# EAGLE design C64_1 (EAGLE 5.12)

## Sheet 1 of 5
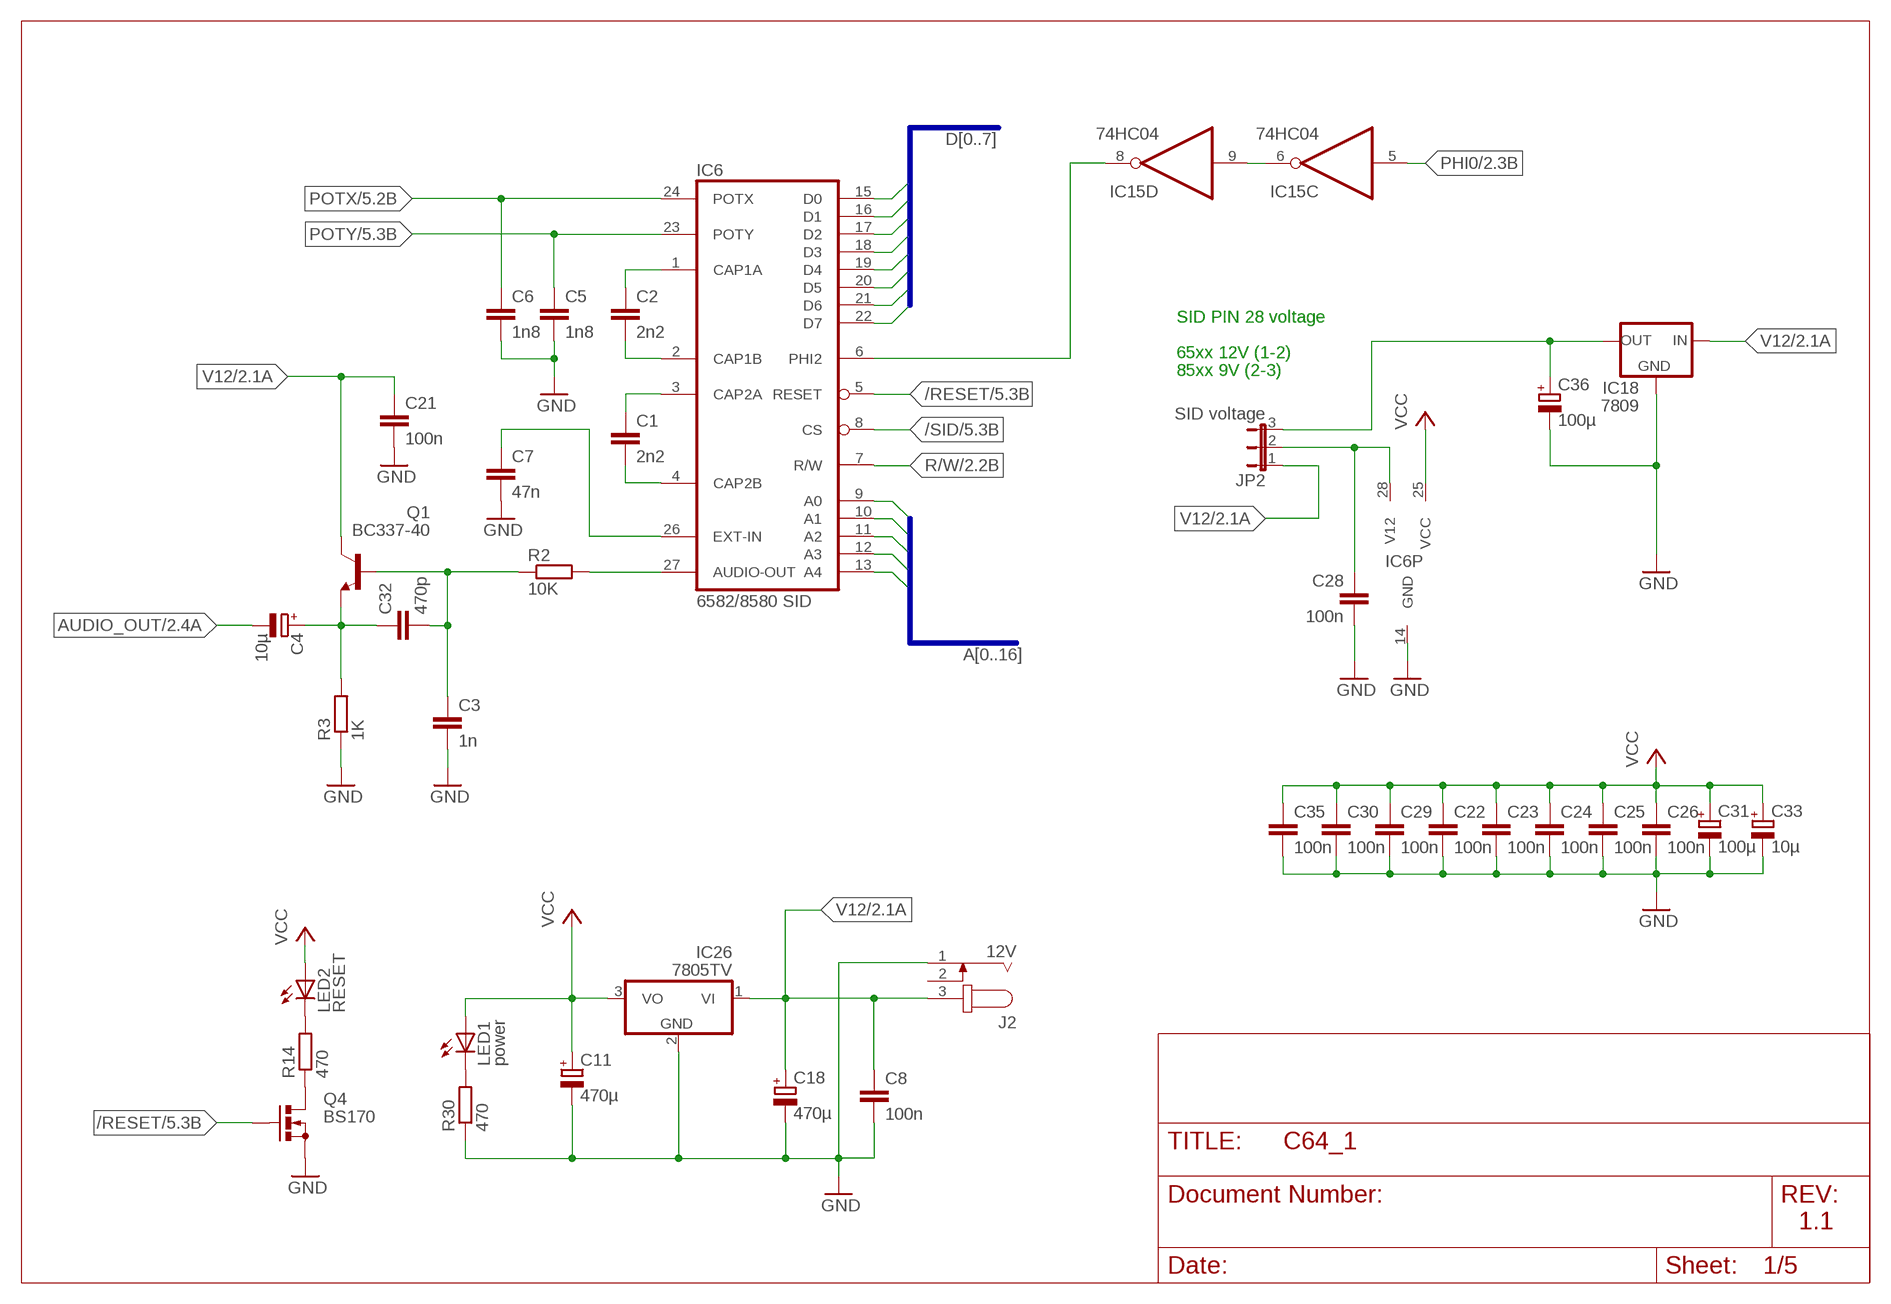
[diagram p0: schematic, sheet 1]

### Parts
C1  2n2  C-EU025-024X044  [C025-024X044]
C2  2n2  C-EU025-024X044  [C025-024X044]
C3  1n  C-EU025-024X044  [C025-024X044]
C4  10µ  CPOL-EUE2.5-6  [E2,5-6]
C5  1n8  C-EU025-024X044  [C025-024X044]
C6  1n8  C-EU025-024X044  [C025-024X044]
C7  47n  C-EU050-024X044  [C050-024X044]
C8  100n  C-EU050-024X044  [C050-024X044]
C11  470µ  CPOL-EUE3.5-8  [E3,5-8]
C18  470µ  CPOL-EUE3.5-8  [E3,5-8]
C21  100n  C-EU050-024X044  [C050-024X044]
C22  100n  C-EU050-024X044  [C050-024X044]
C23  100n  C-EU050-024X044  [C050-024X044]
C24  100n  C-EU050-024X044  [C050-024X044]
C25  100n  C-EU050-024X044  [C050-024X044]
C26  100n  C-EU050-024X044  [C050-024X044]
C28  100n  C-EU050-024X044  [C050-024X044]
C29  100n  C-EU050-024X044  [C050-024X044]
C30  100n  C-EU050-024X044  [C050-024X044]
C31  100µ  CPOL-EUE2.5-6  [E2,5-6]
C32  470p  C-EU025-024X044  [C025-024X044]
C33  10µ  CPOL-EUE2-4  [E2-4]
C35  100n  C-EU050-024X044  [C050-024X044]
C36  100µ  CPOL-EUE2.5-6  [E2,5-6]
IC6  6582/8580 SID  6581  [DIL28]
IC15  74HC04  74LS04N  [DIL14]
IC18  7809  78XXS  [78XXS]
IC26  7805TV  [TO220V]
J2  12V  JACK-PLUG0  [SPC4077]
JP2  SID voltage  JP2E  [JP2]
LED1  power  LED5MM  [LED5MM]
LED2  RESET  LED5MM  [LED5MM]
Q1  BC337-40  [TO92]
Q4  BS170  [SOT54E]
R2  10K  R-EU_0207/2V  [0207/2V]
R3  1K  R-EU_0207/2V  [0207/2V]
R14  470  R-EU_0207/7  [0207/7]
R30  470  R-EU_0207/7  [0207/7]

### Nets
/RESET: IC6.5(RESET) Q4.G ; also sheet 5
/SID: IC6.8(CS) ; also sheet 5
A0: IC6.9(A0) ; also sheet 3,5
A1: IC6.10(A1) ; also sheet 3,5
A2: IC6.11(A2) ; also sheet 3,5
A3: IC6.12(A3) ; also sheet 3,5
A4: IC6.13(A4) ; also sheet 3,5
AUDIO_OUT: C4.- ; also sheet 2
D0: IC6.15(D0) ; also sheet 2,3,5
D1: IC6.16(D1) ; also sheet 2,3,5
D2: IC6.17(D2) ; also sheet 2,3,5
D3: IC6.18(D3) ; also sheet 2,3,5
D4: IC6.19(D4) ; also sheet 2,5
D5: IC6.20(D5) ; also sheet 2,5
D6: IC6.21(D6) ; also sheet 2,5
D7: IC6.22(D7) ; also sheet 2,5
EXT-IN: C7.1 IC6.26(EXT-IN)
GND: C3.2 C5.2 C6.2 C7.2 C8.2 C11.- C18.- C21.2 C22.2 C23.2 C24.2 C25.2 C26.2 C28.2 C29.2 C30.2 C31.- C33.- C35.2 C36.- IC6.14(GND) IC18.GND IC26.2(GND) J2.1 Q4.S R3.1 R30.1 ; also sheet 2,3,4,5
N$1: C2.1 IC6.1(CAP1A)
N$2: C2.2 IC6.2(CAP1B)
N$3: C1.2 IC6.4(CAP2B)
N$4: C1.1 IC6.3(CAP2A)
N$6: C4.+ C32.1 Q1.1(E) R3.2
N$7: C3.1 C32.2 Q1.2(B) R2.1
N$8: LED1.K(C) R30.2
N$9: IC15.6(C:O) IC15.9(D:I)
N$17: LED2.K(C) R14.2
N$18: Q4.D R14.1
PHI0: IC15.5(C:I) ; also sheet 2,4,5
POTX: C6.1 IC6.24(POTX) ; also sheet 5
POTY: C5.1 IC6.23(POTY) ; also sheet 5
R/W: IC6.7(R/W) ; also sheet 2,5
SID_AUDIO_OUT: IC6.27(AUDIO-OUT) R2.2
SID_PHI2: IC6.6(PHI2) IC15.8(D:O)
V9: C36.+ IC18.OUT JP2.3
V12: C8.1 C18.+ C21.1 IC18.IN IC26.1(VI) J2.3 JP2.1 Q1.3(C) ; also sheet 2
V_SID: C28.1 IC6.28(V12) JP2.2
VCC: C11.+ C22.1 C23.1 C24.1 C25.1 C26.1 C29.1 C30.1 C31.+ C33.+ C35.1 IC6.25(VCC) IC26.3(VO) LED1.A LED2.A ; also sheet 2,3,4,5
Unconnected: J2.2

### Buses
D[0..7]
A[0..16]

### Notes on the sheet
- SID PIN 28 voltage
- 65xx 12V (1-2)
- 85xx 9V (2-3)
- 1.1

## Sheet 2 of 5
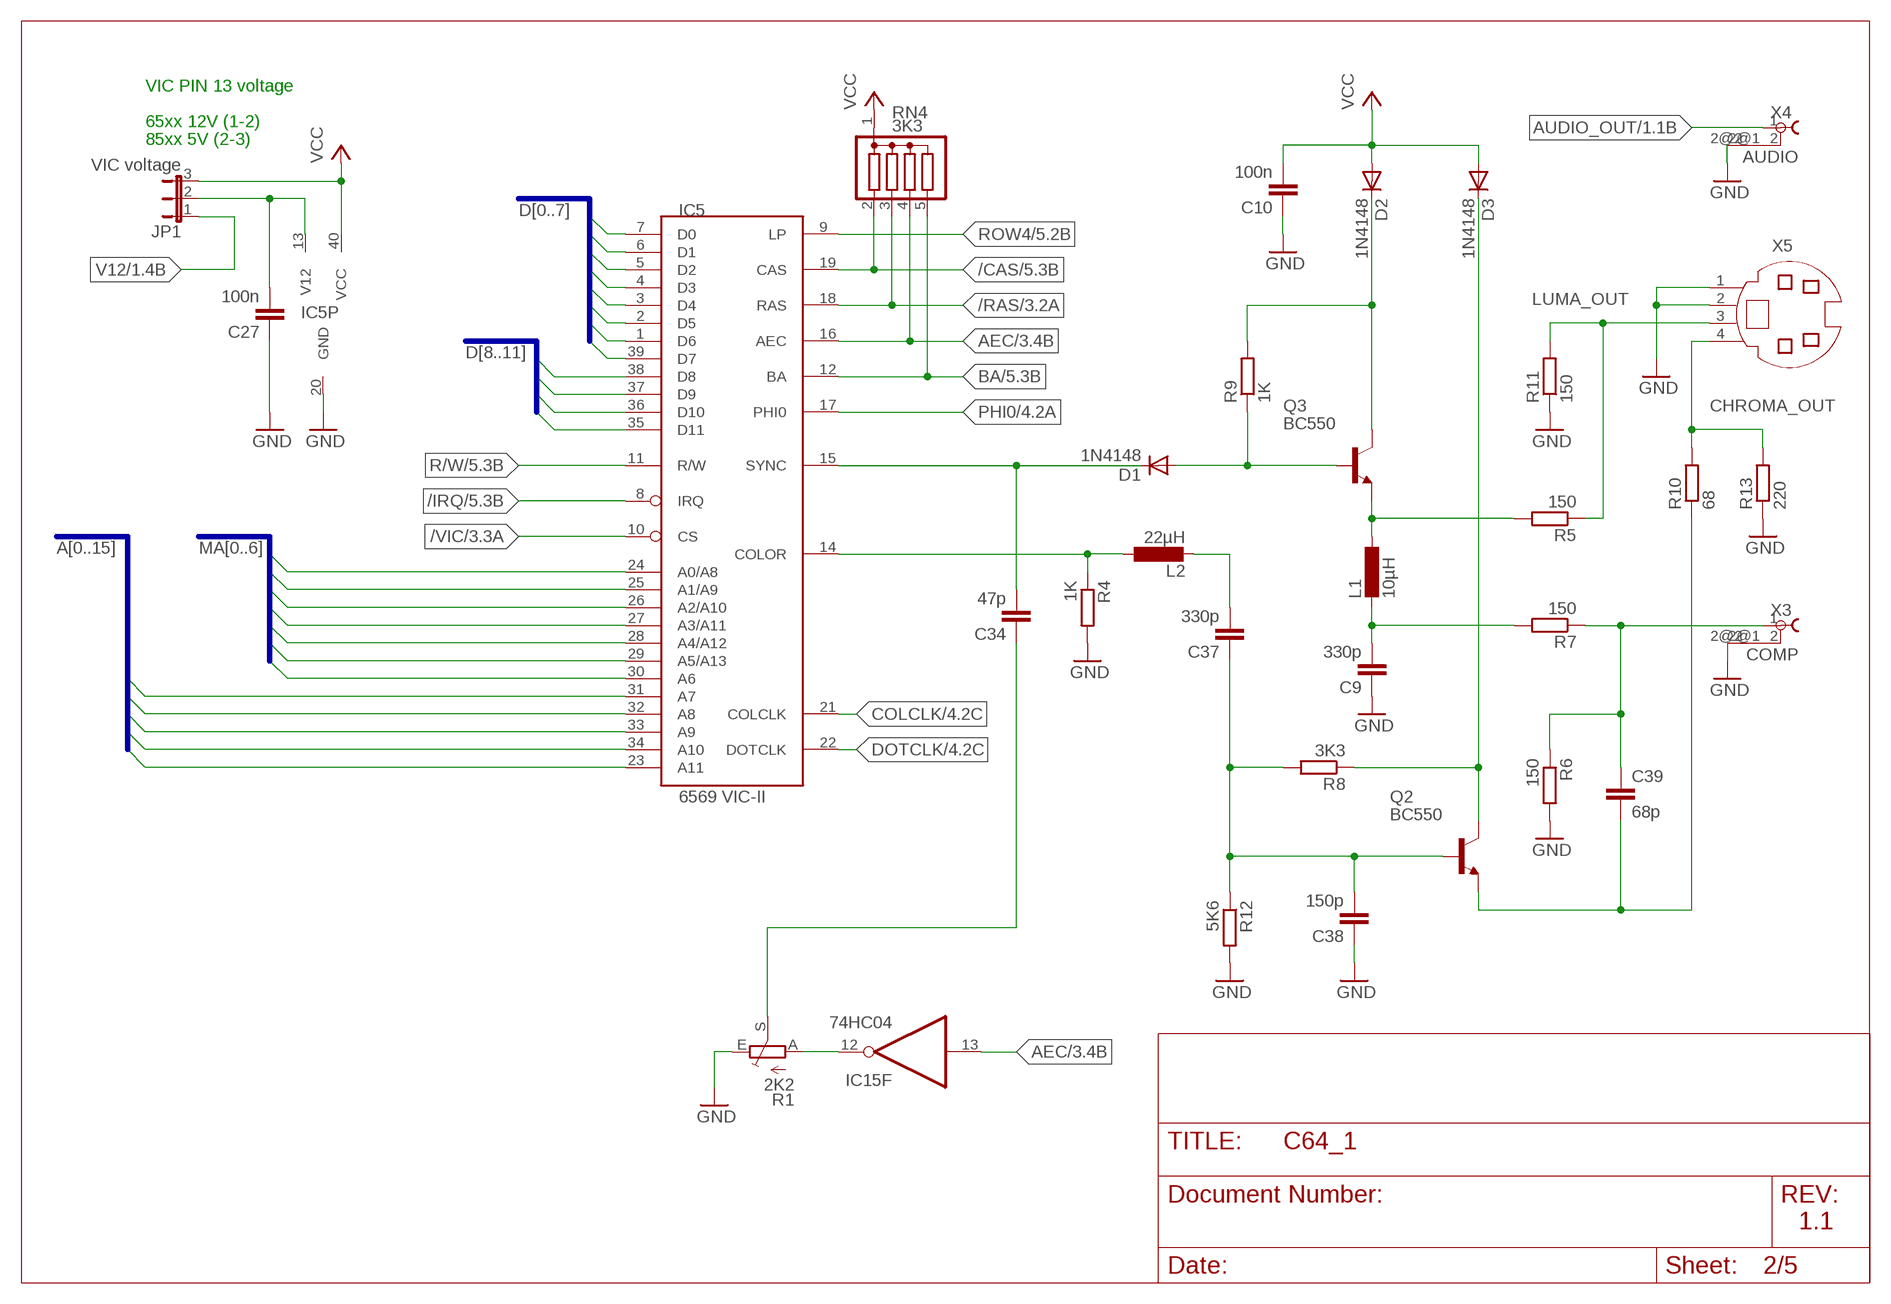
[diagram p1: schematic, sheet 2]

### Parts
C9  330p  C-EU050-024X044  [C050-024X044]
C10  100n  C-EU050-024X044  [C050-024X044]
C27  100n  C-EU050-024X044  [C050-024X044]
C34  47p  C-EU025-024X044  [C025-024X044]
C37  330p  C-EU050-024X044  [C050-024X044]
C38  150p  C-EU050-024X044  [C050-024X044]
C39  68p  C-EU050-024X044  [C050-024X044]
D1  1N4148  1N4148DO35-7  [DO35-7]
D2  1N4148  1N4148DO35-7  [DO35-7]
D3  1N4148  1N4148DO35-7  [DO35-7]
IC5  6569 VIC-II  6569  [DIP40]
JP1  VIC voltage  JP2E  [JP2]
L1  10µH  L-EU0207/2V  [0207/2V]
L2  22µH  L-EU0207/2V  [0207/2V]
Q2  BC550  BC548  [TO92-EBC]
Q3  BC550  BC548  [TO92-EBC]
R1  2K2  TRIM_EU-RJ9W  [RJ9W]
R4  1K  R-EU_0207/2V  [0207/2V]
R5  150  R-EU_0207/7  [0207/7]
R6  150  R-EU_0207/2V  [0207/2V]
R7  150  R-EU_0207/2V  [0207/2V]
R8  3K3  R-EU_0207/2V  [0207/2V]
R9  1K  R-EU_0207/7  [0207/7]
R10  68  R-EU_0207/2V  [0207/2V]
R11  150  R-EU_0207/2V  [0207/2V]
R12  5K6  R-EU_0207/2V  [0207/2V]
R13  220  R-EU_0207/2V  [0207/2V]
RN4  3K3  G04R  [SIL5]
X3  COMP  TOBU3  [TOBU3]
X4  AUDIO  TOBU3  [TOBU3]
X5  MD04SS  [MDIN04SS]

### Nets
/CAS: IC5.19(CAS) RN4.2 ; also sheet 5
/IRQ: IC5.8(IRQ) ; also sheet 5
/RAS: IC5.18(RAS) RN4.3 ; also sheet 3
/VIC: IC5.10(CS) ; also sheet 3,5
A7: IC5.31(A7) ; also sheet 3,5
A8: IC5.32(A8) ; also sheet 3,5
A9: IC5.33(A9) ; also sheet 3,5
A10: IC5.34(A10) ; also sheet 5
A11: IC5.23(A11) ; also sheet 5
AEC: IC5.16(AEC) IC15.13(F:I) RN4.4 ; also sheet 3,5
AUDIO_OUT: X4.1 ; also sheet 1
BA: IC5.12(BA) RN4.5 ; also sheet 5
CHROMA_OUT: R10.2 R13.2 X5.4
COLCLK: IC5.21(COLCLK) ; also sheet 4
COLOR: IC5.14(COLOR) L2.1 R4.1
COMP_OUT: C39.1 R6.1 R7.1 X3.1
D0: IC5.7(D0) ; also sheet 1,3,5
D1: IC5.6(D1) ; also sheet 1,3,5
D2: IC5.5(D2) ; also sheet 1,3,5
D3: IC5.4(D3) ; also sheet 1,3,5
D4: IC5.3(D4) ; also sheet 1,5
D5: IC5.2(D5) ; also sheet 1,5
D6: IC5.1(D6) ; also sheet 1,5
D7: IC5.39(D7) ; also sheet 1,5
D8: IC5.38(D8) ; also sheet 3
D9: IC5.37(D9) ; also sheet 3
D10: IC5.36(D10) ; also sheet 3
D11: IC5.35(D11) ; also sheet 3
DOTCLK: IC5.22(DOTCLK) ; also sheet 4,5
GND: C9.1 C10.1 C27.1 C38.1 IC5.20(GND) R1.E R4.2 R6.2 R11.1 R12.2 R13.1 X3.2@2 X4.2@2 X5.1 X5.2 ; also sheet 1,3,4,5
LUMA_OUT: R5.1 R11.2 X5.3
MA0: IC5.24(A0/A8) ; also sheet 3
MA1: IC5.25(A1/A9) ; also sheet 3
MA2: IC5.26(A2/A10) ; also sheet 3
MA3: IC5.27(A3/A11) ; also sheet 3
MA4: IC5.28(A4/A12) ; also sheet 3
MA5: IC5.29(A5/A13) ; also sheet 3
MA6: IC5.30(A6) ; also sheet 3
N$5: D3.C Q2.C R8.1
N$10: D1.A Q3.B R9.1
N$11: C37.1 C38.2 Q2.B R8.2 R12.1
N$12: D2.C Q3.C R9.2
N$13: C9.2 L1.2 R7.2
N$14: C34.1 R1.S
N$15: L1.1 Q3.E R5.2
N$16: IC15.12(F:O) R1.A
N$19: C37.2 L2.2
N$29: C39.2 Q2.E R10.1
PHI0: IC5.17(PHI0) ; also sheet 1,4,5
R/W: IC5.11(R/W) ; also sheet 1,5
ROW4: IC5.9(LP) ; also sheet 5
SYNC: C34.2 D1.C IC5.15(SYNC)
V12: JP1.1 ; also sheet 1
V_VIC: C27.2 IC5.13(V12) JP1.2
VCC: C10.2 D2.A D3.A IC5.40(VCC) JP1.3 RN4.1 ; also sheet 1,3,4,5
Unconnected: X3.2 X3.2@1 X4.2 X4.2@1

### Buses
D[0..7]
D[8..11]
MA[0..6]
A[0..15]

### Notes on the sheet
- VIC PIN 13 voltage
- 65xx 12V (1-2)
- 85xx 5V (2-3)
- 1.1

## Sheet 3 of 5
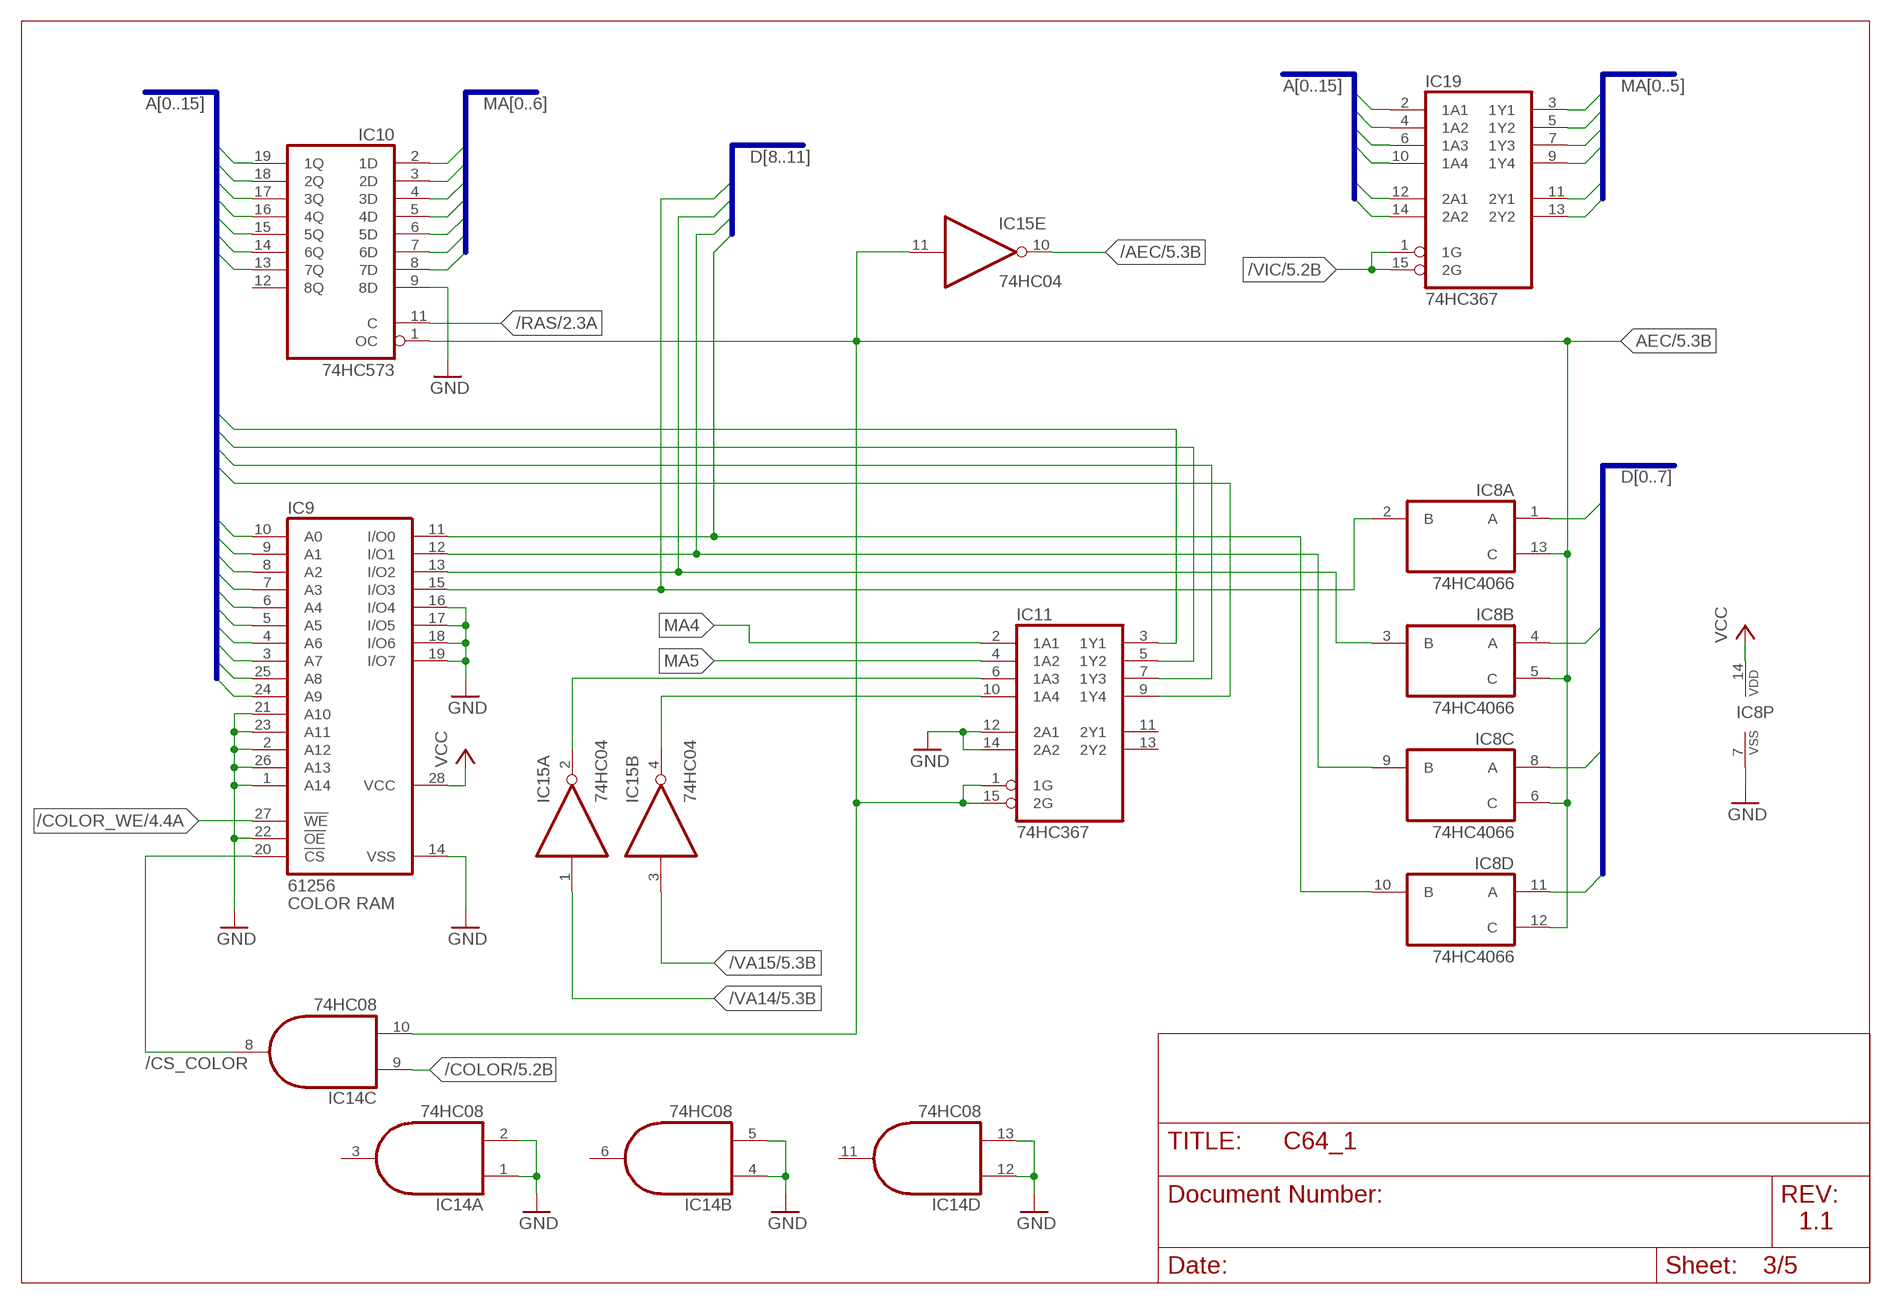
[diagram p2: schematic, sheet 3]

### Parts
IC8  74HC4066  4066N  [DIL14]
IC9  61256  62832P  [DIL28-3]
IC10  74HC573  74HC573N  [DIL20]
IC11  74HC367  74367N  [DIL16]
IC14  74HC08  74LS08N  [DIL14]
IC19  74HC367  74367N  [DIL16]

### Nets
/AEC: IC15.10(E:O) ; also sheet 5
/COLOR: IC14.9(C:I0) ; also sheet 5
/COLOR_WE: IC9.27(!WE) ; also sheet 4
/CS_COLOR: IC9.20(!CS) IC14.8(C:O)
/RAS: IC10.11(C) ; also sheet 2
/VA14: IC15.1(A:I) ; also sheet 5
/VA15: IC15.3(B:I) ; also sheet 5
/VIC: IC19.1(1G) IC19.15(2G) ; also sheet 2,5
A0: IC9.10(A0) IC10.19(1Q) IC19.2(1A1) ; also sheet 1,5
A1: IC9.9(A1) IC10.18(2Q) IC19.4(1A2) ; also sheet 1,5
A2: IC9.8(A2) IC10.17(3Q) IC19.6(1A3) ; also sheet 1,5
A3: IC9.7(A3) IC10.16(4Q) IC19.10(1A4) ; also sheet 1,5
A4: IC9.6(A4) IC10.15(5Q) IC19.12(2A1) ; also sheet 1,5
A5: IC9.5(A5) IC10.14(6Q) IC19.14(2A2) ; also sheet 5
A6: IC9.4(A6) IC10.13(7Q) ; also sheet 5
A7: IC9.3(A7) ; also sheet 2,5
A8: IC9.25(A8) ; also sheet 2,5
A9: IC9.24(A9) ; also sheet 2,5
A12: IC11.3(1Y1) ; also sheet 5
A13: IC11.5(1Y2) ; also sheet 5
A14: IC11.7(1Y3) ; also sheet 5
A15: IC11.9(1Y4) ; also sheet 5
AEC: IC8.5(B:C) IC8.6(C:C) IC8.12(D:C) IC8.13(A:C) IC10.1(OC) IC11.1(1G) IC11.15(2G) IC14.10(C:I1) IC15.11(E:I) ; also sheet 2,5
D0: IC8.11(D:A) ; also sheet 1,2,5
D1: IC8.8(C:A) ; also sheet 1,2,5
D2: IC8.4(B:A) ; also sheet 1,2,5
D3: IC8.1(A:A) ; also sheet 1,2,5
D8: IC8.10(D:B) IC9.11(I/O0) ; also sheet 2
D9: IC8.9(C:B) IC9.12(I/O1) ; also sheet 2
D10: IC8.3(B:B) IC9.13(I/O2) ; also sheet 2
D11: IC8.2(A:B) IC9.15(I/O3) ; also sheet 2
GND: IC8.7(P:VSS) IC9.1(A14) IC9.2(A12) IC9.14(VSS) IC9.16(I/O4) IC9.17(I/O5) IC9.18(I/O6) IC9.19(I/O7) IC9.21(A10) IC9.22(!OE) IC9.23(A11) IC9.26(A13) IC10.9(8D) IC11.12(2A1) IC11.14(2A2) IC14.1(A:I0) IC14.2(A:I1) IC14.4(B:I0) IC14.5(B:I1) IC14.12(D:I0) IC14.13(D:I1) ; also sheet 1,2,4,5
MA0: IC10.2(1D) IC19.3(1Y1) ; also sheet 2
MA1: IC10.3(2D) IC19.5(1Y2) ; also sheet 2
MA2: IC10.4(3D) IC19.7(1Y3) ; also sheet 2
MA3: IC10.5(4D) IC19.9(1Y4) ; also sheet 2
MA4: IC10.6(5D) IC11.2(1A1) IC19.11(2Y1) ; also sheet 2
MA5: IC10.7(6D) IC11.4(1A2) IC19.13(2Y2) ; also sheet 2
MA6: IC10.8(7D) ; also sheet 2
VA14: IC11.6(1A3) IC15.2(A:O)
VA15: IC11.10(1A4) IC15.4(B:O)
VCC: IC8.14(P:VDD) IC9.28(VCC) ; also sheet 1,2,4,5
Unconnected: IC10.12(8Q) IC11.11(2Y1) IC11.13(2Y2) IC14.3(A:O) IC14.6(B:O) IC14.11(D:O)

### Buses
D[0..7]
A[0..15]
MA[0..5]
D[8..11]
MA[0..6]

### Notes on the sheet
- COLOR RAM
- 1.1

## Sheet 4 of 5
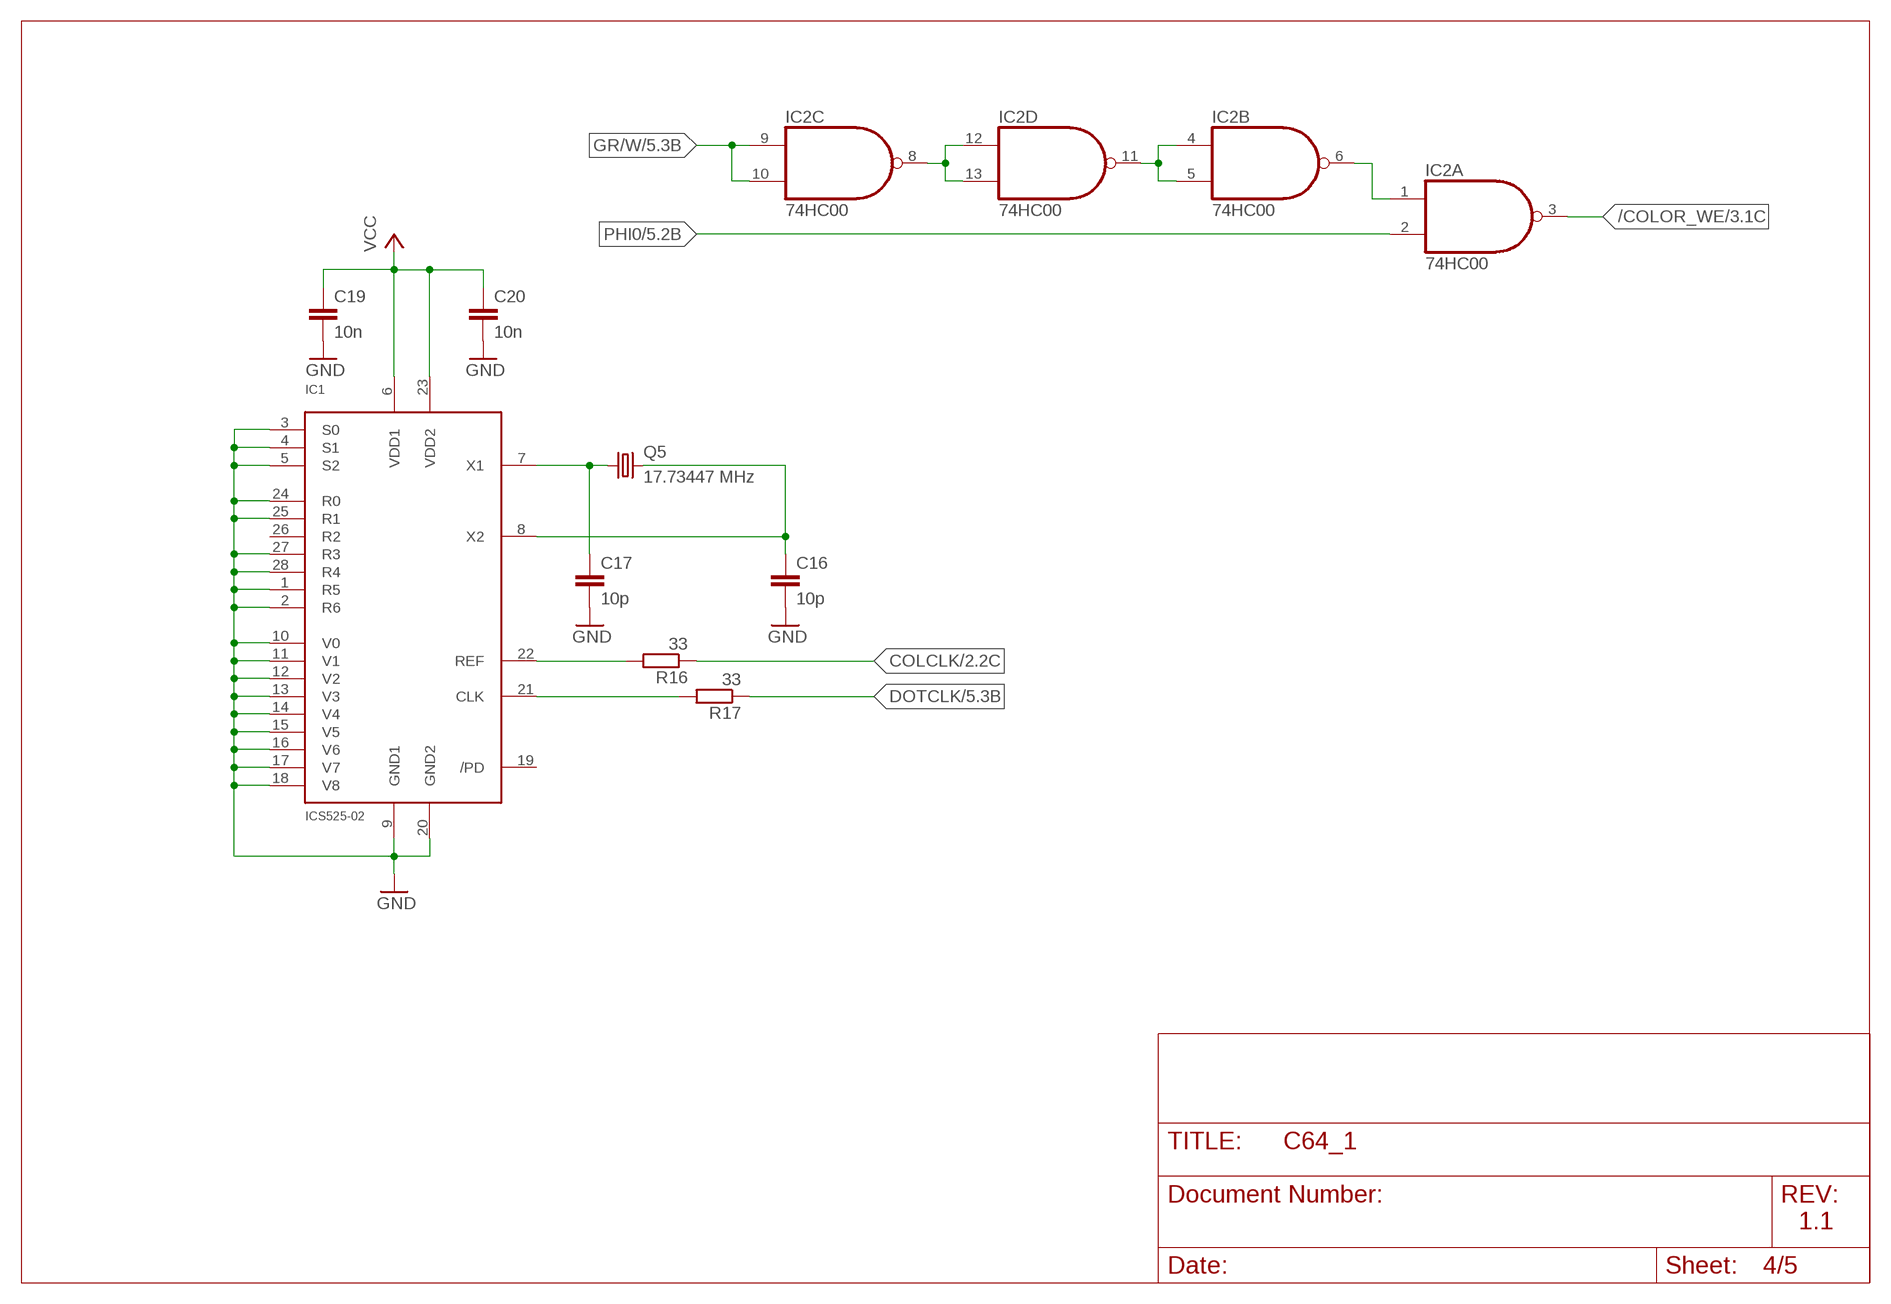
[diagram p3: schematic, sheet 4]

### Parts
C16  10p  C-EU025-024X044  [C025-024X044]
C17  10p  C-EU025-024X044  [C025-024X044]
C19  10n  C-EU025-024X044  [C025-024X044]
C20  10n  C-EU025-024X044  [C025-024X044]
IC1  ICS525-02  ICS525  [SSOP-28]
IC2  74HC00  7400N  [DIL14]
Q5  17.73447 MHz  CRYSTALHC49S  [HC49/S]
R16  33  R-EU_0207/7  [0207/7]
R17  33  R-EU_0207/7  [0207/7]

### Nets
/COLOR_WE: IC2.3(A:O) ; also sheet 3
COLCLK: R16.1 ; also sheet 2
DOTCLK: R17.1 ; also sheet 2,5
GND: C16.2 C17.2 C19.2 C20.2 IC1.1(R5) IC1.2(R6) IC1.3(S0) IC1.4(S1) IC1.5(S2) IC1.9(GND1) IC1.10(V0) IC1.11(V1) IC1.12(V2) IC1.13(V3) IC1.14(V4) IC1.15(V5) IC1.16(V6) IC1.17(V7) IC1.18(V8) IC1.20(GND2) IC1.24(R0) IC1.25(R1) IC1.27(R3) IC1.28(R4) ; also sheet 1,2,3,5
GR/W: IC2.9(C:I0) IC2.10(C:I1) ; also sheet 5
N$20: IC2.8(C:O) IC2.12(D:I0) IC2.13(D:I1)
N$21: IC2.1(A:I0) IC2.6(B:O)
N$22: C17.1 IC1.7(X1) Q5.1
N$23: C16.1 IC1.8(X2) Q5.2
N$24: IC1.22(REF) R16.2
N$25: IC1.21(CLK) R17.2
N$26: IC2.4(B:I0) IC2.5(B:I1) IC2.11(D:O)
PHI0: IC2.2(A:I1) ; also sheet 1,2,5
VCC: C19.1 C20.1 IC1.6(VDD1) IC1.23(VDD2) ; also sheet 1,2,3,5
Unconnected: IC1.19(/PD) IC1.26(R2)

### Notes on the sheet
- 1.1

## Sheet 5 of 5
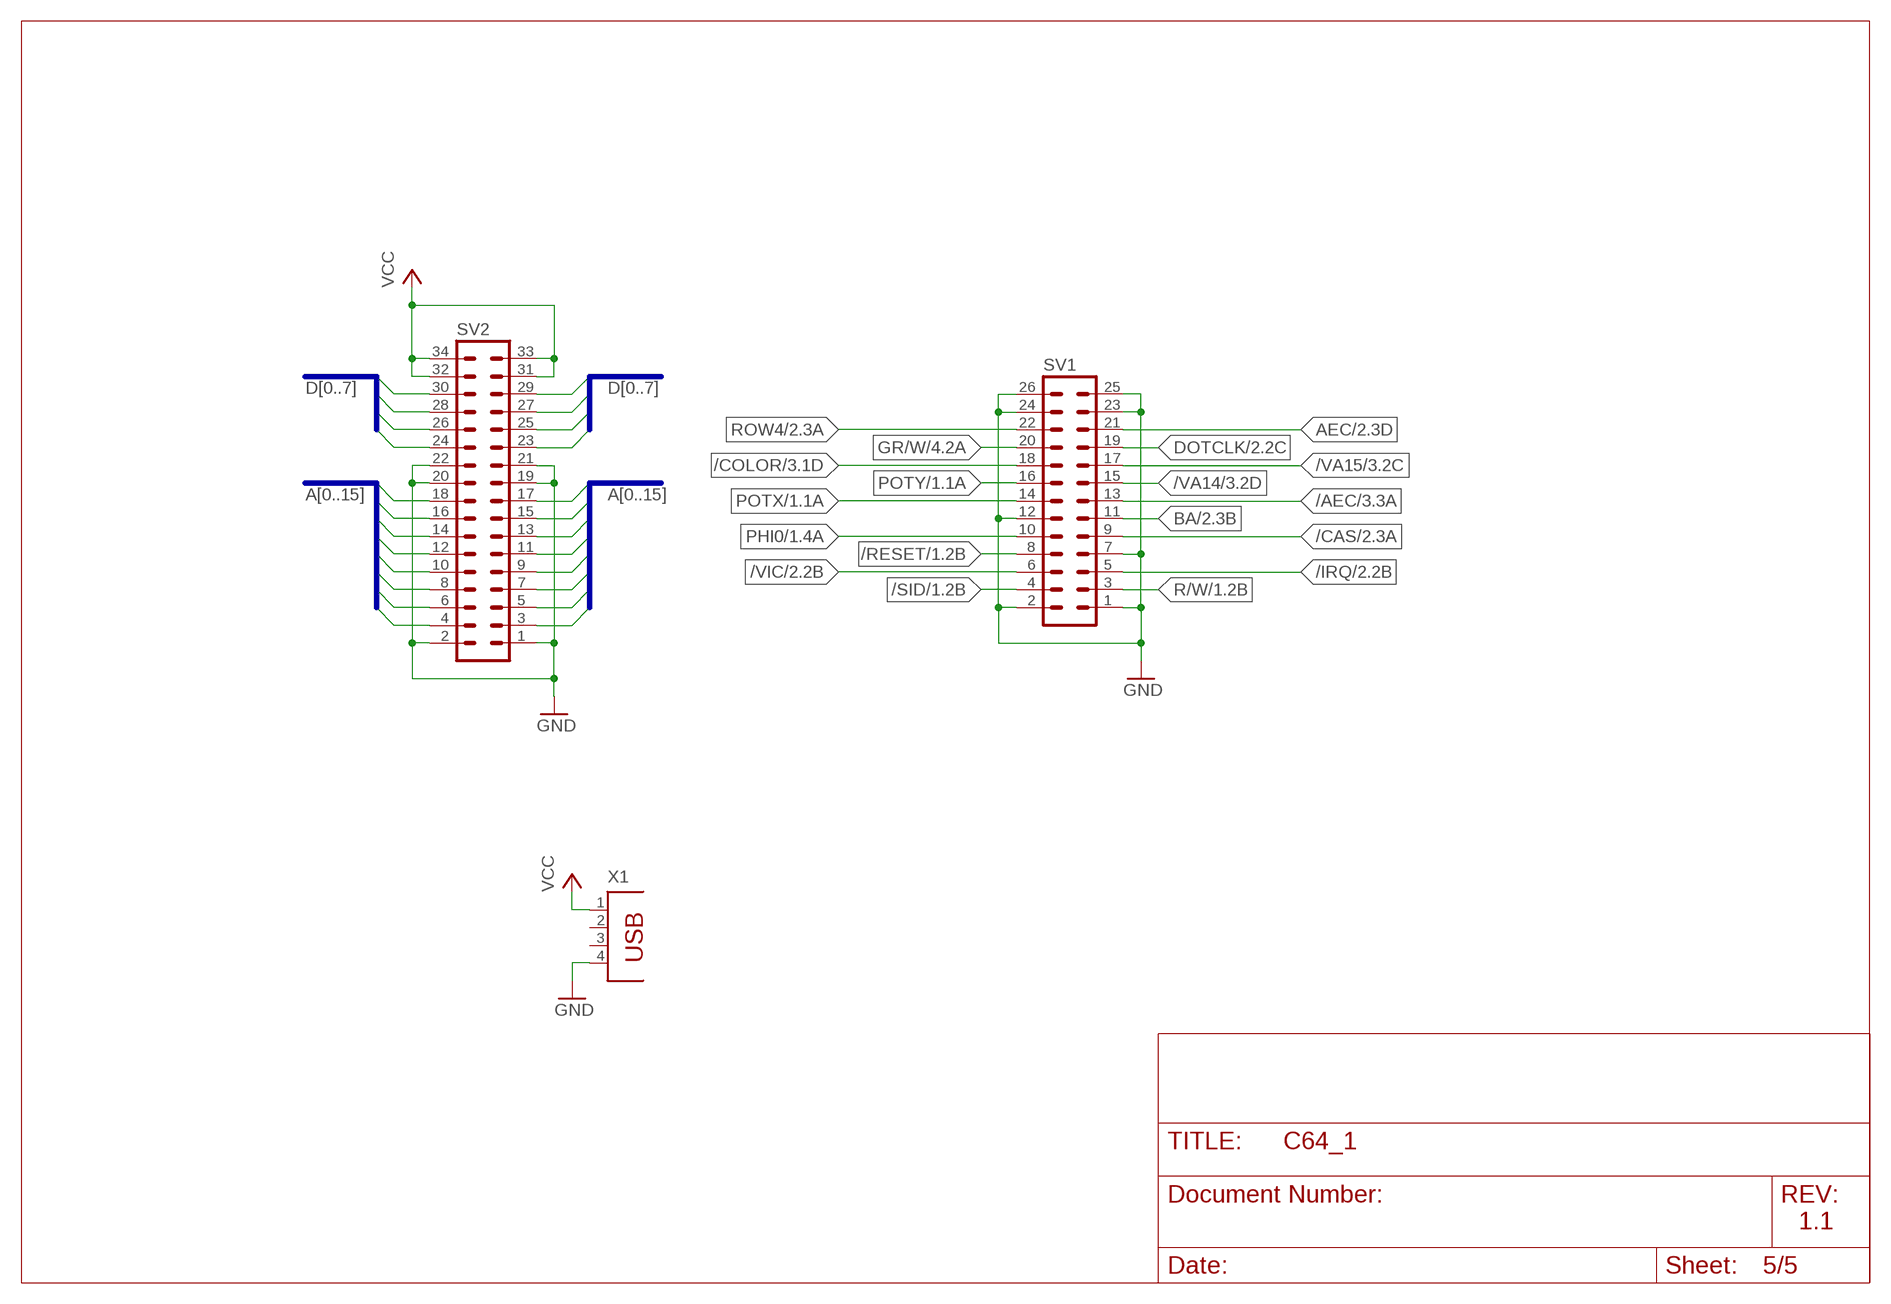
[diagram p4: schematic, sheet 5]

### Parts
SV1  MA13-2  [MA13-2]
SV2  MA17-2  [MA17-2]
X1  PN87520  [PN87520]

### Nets
/AEC: SV1.13 ; also sheet 3
/CAS: SV1.9 ; also sheet 2
/COLOR: SV1.18 ; also sheet 3
/IRQ: SV1.5 ; also sheet 2
/RESET: SV1.8 ; also sheet 1
/SID: SV1.4 ; also sheet 1
/VA14: SV1.15 ; also sheet 3
/VA15: SV1.17 ; also sheet 3
/VIC: SV1.6 ; also sheet 2,3
A0: SV2.3 ; also sheet 1,3
A1: SV2.4 ; also sheet 1,3
A2: SV2.5 ; also sheet 1,3
A3: SV2.6 ; also sheet 1,3
A4: SV2.7 ; also sheet 1,3
A5: SV2.8 ; also sheet 3
A6: SV2.9 ; also sheet 3
A7: SV2.10 ; also sheet 2,3
A8: SV2.11 ; also sheet 2,3
A9: SV2.12 ; also sheet 2,3
A10: SV2.13 ; also sheet 2
A11: SV2.14 ; also sheet 2
A12: SV2.15 ; also sheet 3
A13: SV2.16 ; also sheet 3
A14: SV2.17 ; also sheet 3
A15: SV2.18 ; also sheet 3
AEC: SV1.21 ; also sheet 2,3
BA: SV1.11 ; also sheet 2
D0: SV2.23 ; also sheet 1,2,3
D1: SV2.24 ; also sheet 1,2,3
D2: SV2.25 ; also sheet 1,2,3
D3: SV2.26 ; also sheet 1,2,3
D4: SV2.27 ; also sheet 1,2
D5: SV2.28 ; also sheet 1,2
D6: SV2.29 ; also sheet 1,2
D7: SV2.30 ; also sheet 1,2
DOTCLK: SV1.19 ; also sheet 2,4
GND: SV1.1 SV1.2 SV1.7 SV1.12 SV1.23 SV1.24 SV1.25 SV1.26 SV2.1 SV2.2 SV2.19 SV2.20 SV2.21 SV2.22 X1.4 ; also sheet 1,2,3,4
GR/W: SV1.20 ; also sheet 4
PHI0: SV1.10 ; also sheet 1,2,4
POTX: SV1.14 ; also sheet 1
POTY: SV1.16 ; also sheet 1
R/W: SV1.3 ; also sheet 1,2
ROW4: SV1.22 ; also sheet 2
VCC: SV2.31 SV2.32 SV2.33 SV2.34 X1.1 ; also sheet 1,2,3,4
Unconnected: X1.2 X1.3

### Buses
A[0..15]
D[0..7]

### Notes on the sheet
- 1.1

## Power pins joined to a net without a drawn wire
GND: IC2.7(P:GND) IC10.10(GND) IC11.8(GND) IC14.7(P:GND) IC15.7(P:GND) IC19.8(GND)
VCC: IC2.14(P:VCC) IC10.20(VCC) IC11.16(VCC) IC14.14(P:VCC) IC15.14(P:VCC) IC19.16(VCC)

## Library data of the parts
C1-C3 C5-C10 C16 C17 C19-C30 C32 C34 C35 C37-C39 = rcl:C-EU: CAPACITOR, European symbol
C4 C11 C18 C31 C33 C36 = rcl:CPOL-EU: POLARIZED CAPACITOR, European symbol
D1-D3 = diode:1N4148: DIODE high speed (Philips)
IC1 = SP_ICS:ICS525: ICS525-01
IC2 = 74xx-us:74*00: Quad 2-input NAND gate
IC5 = 0RB_65xx:6569
IC6 = 0RB_65xx:6581
IC8 = 40xx:4066: Quad bilateral ANALOG SWITCH
IC9 = memory-hitachi:62832P: MEMORY; OC_FARNELL: unknown; OC_NEWARK: unknown
IC10 = 74xx-us:74*573: 8-bit D latch BUS DRIVER
IC11 IC19 = 74xx-us:74*367: Hex BUS DRIVER, 3-state
IC14 = 74xx-us:74*08: Quad 2-input AND gate
IC15 = 74xx-us:74*04: Hex INVERTER
IC18 = v-reg:78XXS: VOLTAGE REGULATOR
IC26 = linear:78*: Positive VOLTAGE REGULATOR Source: http://cache.national.com/ds/LM/LM78L05.pdf http://www.fairchildsemi.com/ds/LM/LM7805.pdf
J2 = con-jack:JACK-PLUG: DC POWER JACK Power Jack, DC, Right Angle, Through Hole, Rated 5A at 16VDC, PC Terminals Distributor: Farnell (www.Farnell.de) Drawing: 84N1161.pdf / 84N1162.pdf Manufacturer: SPC Technology (www.spctechnology.com) Type: SPC4077 / SPC 4078; OC_FARNELL: unknown; OC_NEWARK: unknown
JP1 JP2 = jumper:JP2E: JUMPER
L1 L2 = rcl:L-EU: INDUCTOR, European symbol
LED1 LED2 = led:LED: LED OSRAM: - CHIPLED LG R971, LG N971, LY N971, LG Q971, LY Q971, LO R971, LY R971 LH N974, LH R974 LS Q976, LO Q976, LY Q976 LO Q996 - Hyper CHIPLED LW Q18S LB Q993, LB Q99A, LB R99A - SideLED LS A670, LO A670, LY A670, LG A670, LP A670 LB A673, LV A673, LT A673, LW A673 LH A674 LY A675 LS A676, LA A676, LO A676, LY A676, LW A676 LS A679, LY A679, LG A679 - Hyper Micro SIDELED® LS Y876, LA Y876, LO Y876, LY Y876 LT Y87S - SmartLED LW L88C, LW L88S LB L89C, LB L89S, LG L890 LS L89K, LO L89K, LY L89K LS L896, LA L896, LO L896, LY L896 - TOPLED LS T670, LO T670, LY T670, LG T670, LP T670 LSG T670, LSP T670, LSY T670, LOP T670, LYG T670 LG T671, LOG T671, LSG T671 LB T673, LV T673, LT T673, LW T673 LH T674 LS T676, LA T676, LO T676, LY T676, LB T676, LH T676, LSB T676, LW T676 LB T67C, LV T67C, LT T67C, LS T67K, LO T67K, LY T67K, LW E67C LS E67B, LA E67B, LO E67B, LY E67B, LB E67C, LV E67C, LT E67C LW T67C LS T679, LY T679, LG T679 LS T770, LO T770, LY T770, LG T770, LP T770 LB T773, LV T773, LT T773, LW T773 LH T774 LS E675, LA E675, LY E675, LS T675 LS T776, LA T776, LO T776, LY T776, LB T776 LHGB T686 LT T68C, LB T68C - Hyper Mini TOPLED® LB M676 - Mini TOPLED Santana® LG M470 LS M47K, LO M47K, LY M47K Source: http://www.osram.convergy.de LUXEON: - LUMILED® LXK2-PW12-R00, LXK2-PW12-S00, LXK2-PW14-U00, LXK2-PW14-V00 LXK2-PM12-R00, LXK2-PM12-S00, LXK2-PM14-U00 LXK2-PE12-Q00, LXK2-PE12-R00, LXK2-PE12-S00, LXK2-PE14-T00, LXK2-PE14-U00 LXK2-PB12-K00, LXK2-PB12-L00, LXK2-PB12-M00, LXK2-PB14-N00, LXK2-PB14-P00, LXK2-PB14-Q00 LXK2-PR12-L00, LXK2-PR12-M00, LXK2-PR14-Q00, LXK2-PR14-R00 LXK2-PD12-Q00, LXK2-PD12-R00, LXK2-PD12-S00 LXK2-PH12-R00, LXK2-PH12-S00 LXK2-PL12-P00, LXK2-PL12-Q00, LXK2-PL12-R00 Source: www.luxeon.com KINGBRIGHT: KA-3528ASYC Source: www.kingbright.com
Q1 = transistor-npn:BC337*: NPN Transistor
Q2 Q3 = transistor-npn:BC548*: NPN Transistor
Q4 = transistor-small-signal:BS170: N-CHANNEL MOS FET
Q5 = crystal:CRYSTAL: CRYSTAL; OC_FARNELL: 1667008; OC_NEWARK: unknown
R1 = pot:TRIM_EU-: POTENTIOMETER
R2-R14 R16 R17 R30 = rcl:R-EU_: RESISTOR, European symbol
RN4 = resistor-sil:G04R: SIL RESISTOR; OC_FARNELL: unknown; OC_NEWARK: unknown
SV1 = con-lstb:MA13-2: PIN HEADER; OC_FARNELL: unknown; OC_NEWARK: unknown
SV2 = con-lstb:MA17-2: PIN HEADER; OC_FARNELL: unknown; OC_NEWARK: unknown
X1 = con-berg:PN87520: BERG USB connector; OC_FARNELL: unknown; OC_NEWARK: unknown
X3 X4 = con-hirschmann:TOBU3: Female Cinch CONNECTOR ( RCA Jack ); MF: FARNELL; MPN: TOBU 3; OC_FARNELL: 592791; OC_NEWARK: 06WX5914
X5 = con-yamaichi:MD04SS: YAMAICHI CONNECTOR; OC_FARNELL: unknown; OC_NEWARK: unknown

## Board
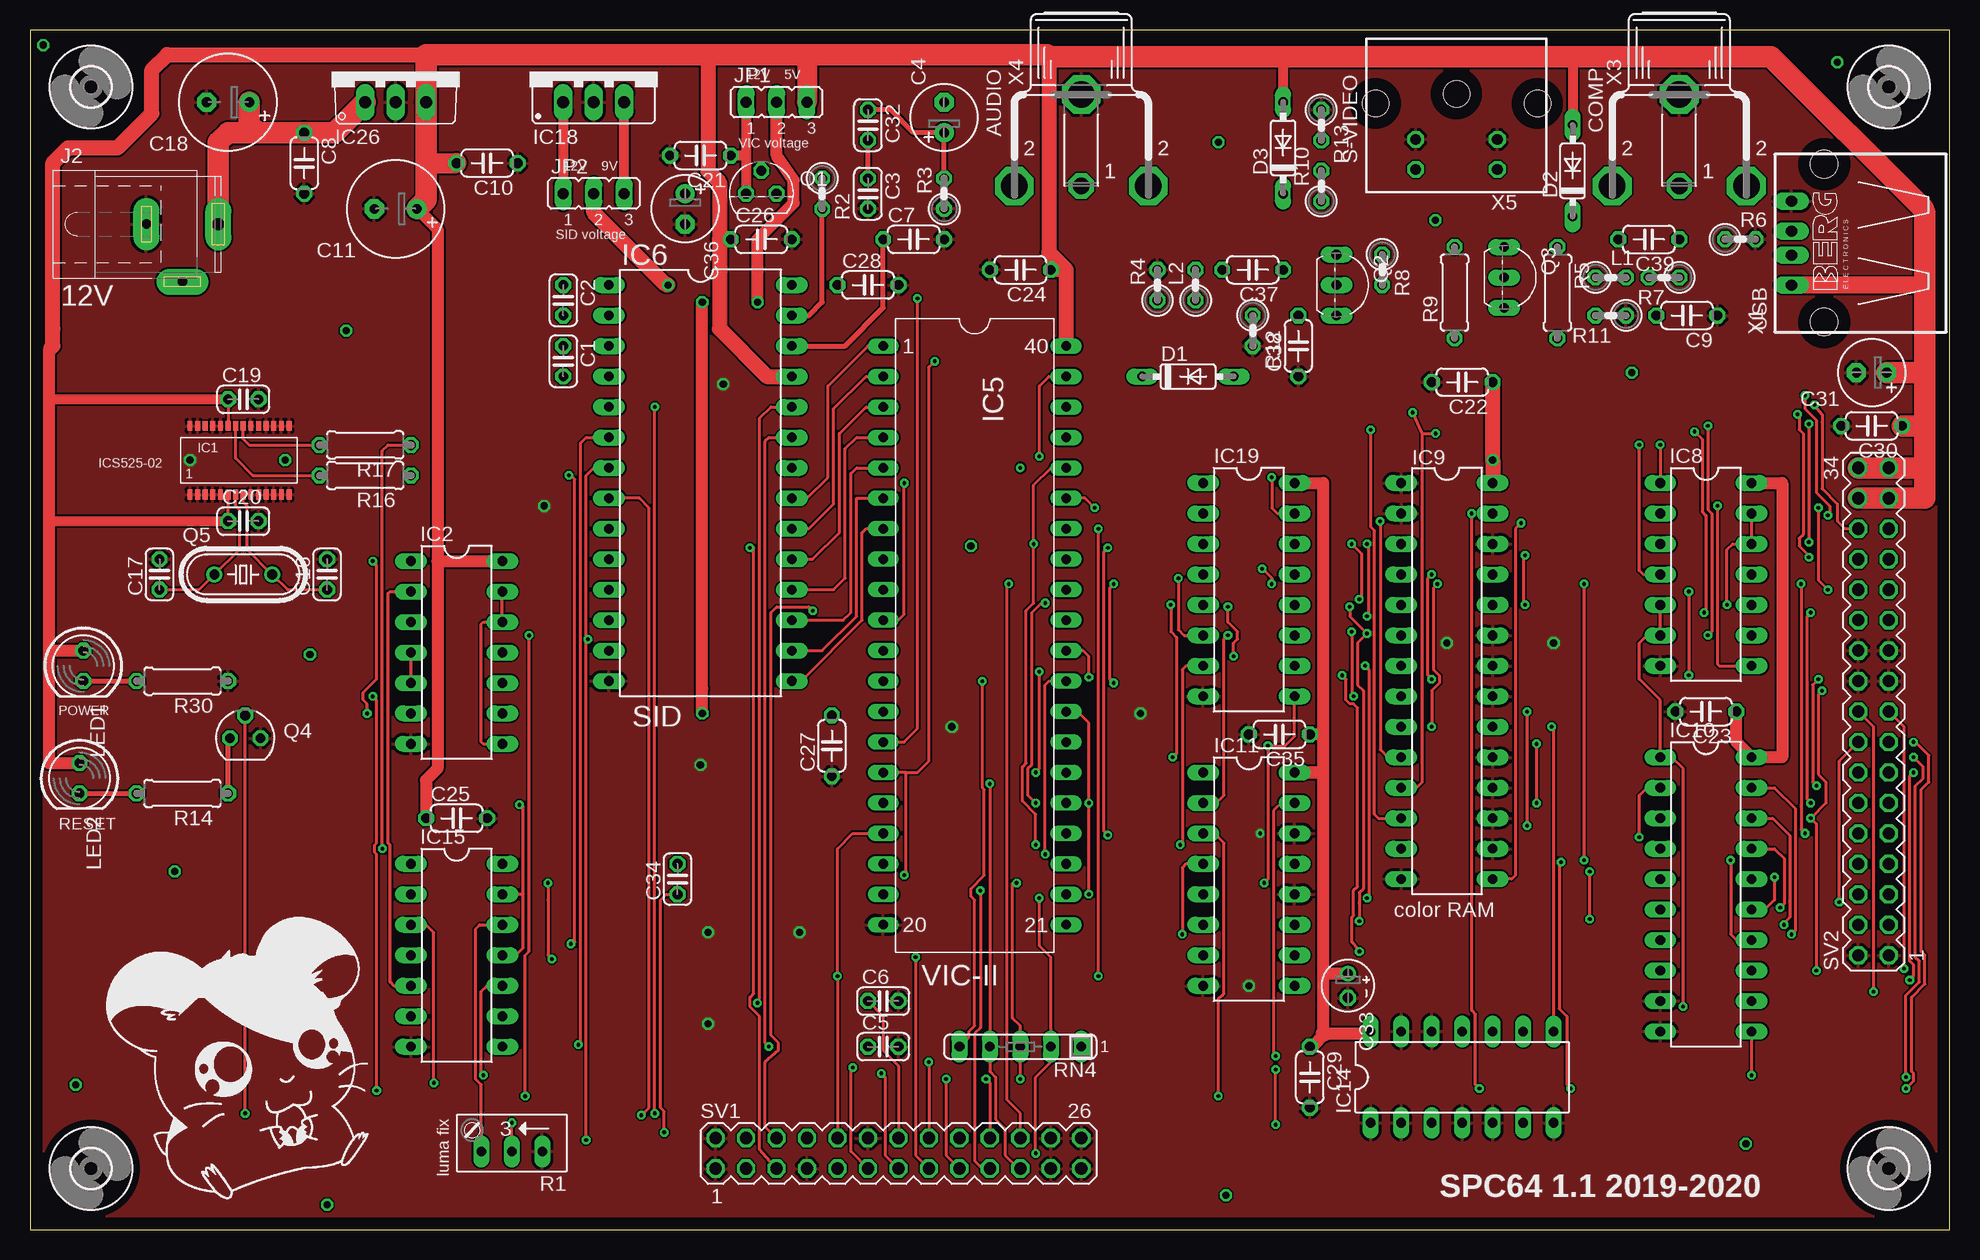
[diagram p5: board, top side]
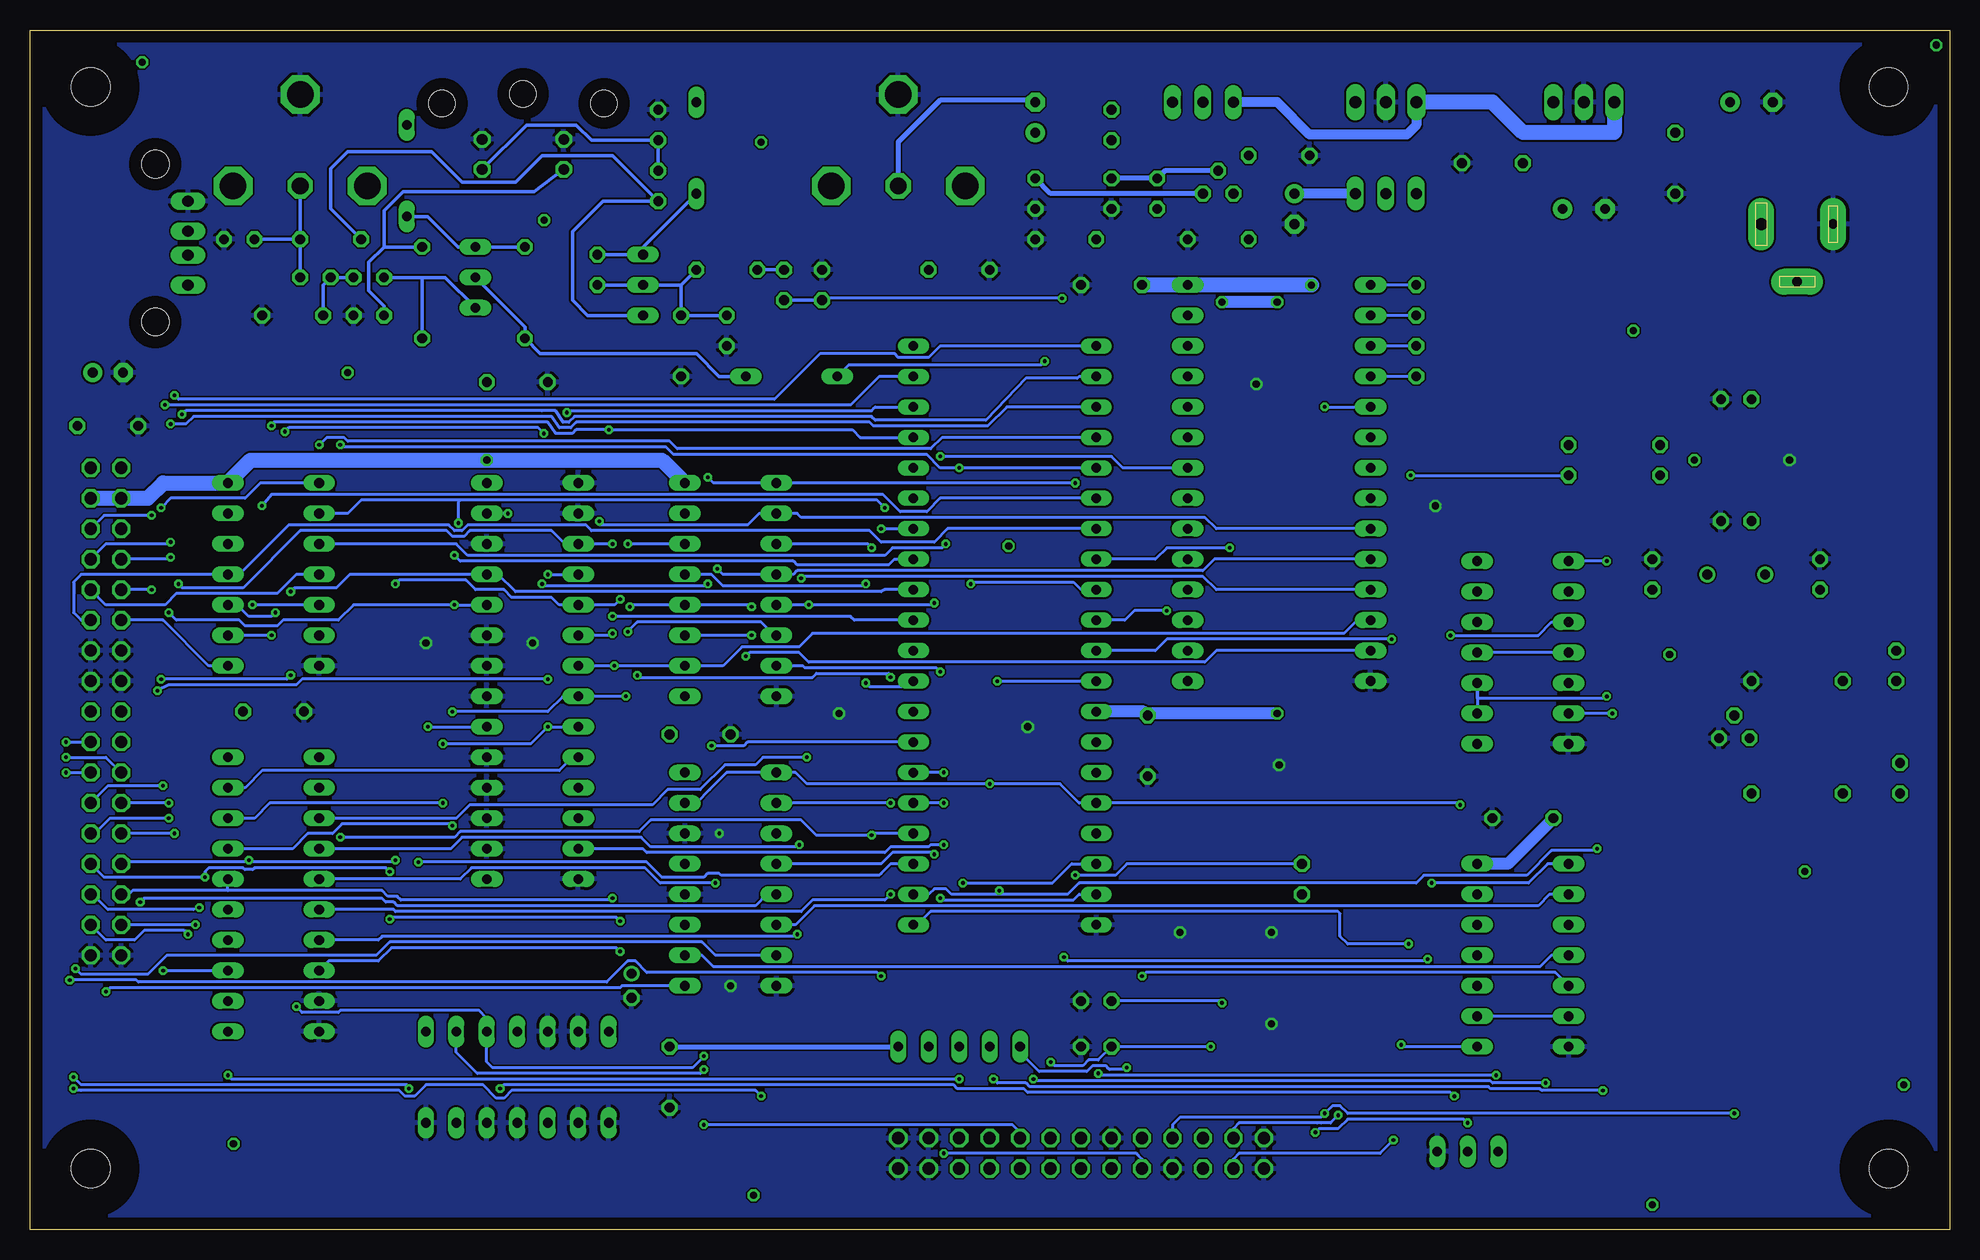
[diagram p6: board, bottom side, seen from below]

Size 160 x 100 mm. Coordinates in mm from the lower left corner, seen from the top.
Outline: 0,0 160,0 160,100 0,100 0,0
Copper layers (1*16): Top 0.035mm / dielectric 1.5mm / Bottom 0.035mm
Design rules "default *": minimum track width 10mil, minimum drill 12mil, track to track 6mil, track to pad 6mil, pad to pad 6mil, via to via 6mil, smd to smd 6mil, copper to edge 40mil, drill to drill 8mil, minimum pad ring 10mil, minimum via ring 8mil, stop-mask expansion 4mil, vias tented up to drill 0mil, thermal gap 10mil

### Footprints (pad centres in the part's own frame; a part is rotated, then mirrored left to right if it is on the bottom)
C025-024X044 = drill 0.813 octagon: 1 -1.27,0; 2 1.27,0
E2,5-6 = drill 0.813 pad 1.6 round: + -1.27,0 | drill 0.813 pad 1.6 octagon: - 1.27,0
C050-024X044 = drill 0.813 octagon: 1 -2.54,0; 2 2.54,0
E3,5-8 = drill 0.813 pad 1.6 round: + -1.778,0 | drill 0.813 pad 1.6 octagon: - 1.778,0
E2-4 = drill 0.813 pad 1.27 round: + -1.016,0 | drill 0.813 pad 1.27 octagon: - 1.016,0
DO35-7 = drill 0.813 long: A 3.81,0; C -3.81,0
SSOP-28 = smd 0.406 x 0.813: 1 -3.81,-1.587; 2 -3.175,-1.587; 3 -2.54,-1.587; 4 -1.905,-1.587; 5 -1.27,-1.587; 6 -0.635,-1.587; 7 0,-1.587; 8 0.635,-1.587; 9 1.27,-1.587; 10 1.905,-1.587; 11 2.54,-1.587; 12 3.175,-1.587; 13 3.81,-1.587; 14 4.445,-1.587; 15 4.445,4.128; 16 3.81,4.128; 17 3.175,4.128; 18 2.54,4.128; 19 1.905,4.128; 20 1.27,4.128; 21 0.635,4.128; 22 0,4.128; 23 -0.635,4.128; 24 -1.27,4.128; 25 -1.905,4.128; 26 -2.54,4.128; 27 -3.175,4.128; 28 -3.81,4.128
DIL14 = drill 0.813 long: 1 -7.62,-3.81; 2 -5.08,-3.81; 3 -2.54,-3.81; 4 0,-3.81; 5 2.54,-3.81; 6 5.08,-3.81; 7 7.62,-3.81; 8 7.62,3.81; 9 5.08,3.81; 10 2.54,3.81; 11 0,3.81; 12 -2.54,3.81; 13 -5.08,3.81; 14 -7.62,3.81
DIP40 = drill 0.8 pad 1.27 long: 1 -24.13,-7.62; 2 -21.59,-7.62; 3 -19.05,-7.62; 4 -16.51,-7.62; 5 -13.97,-7.62; 6 -11.43,-7.62; 7 -8.89,-7.62; 8 -6.35,-7.62; 9 -3.81,-7.62; 10 -1.27,-7.62; 11 1.27,-7.62; 12 3.81,-7.62; 13 6.35,-7.62; 14 8.89,-7.62; 15 11.43,-7.62; 16 13.97,-7.62; 17 16.51,-7.62; 18 19.05,-7.62; 19 21.59,-7.62; 20 24.13,-7.62; 21 24.13,7.62; 22 21.59,7.62; 23 19.05,7.62; 24 16.51,7.62; 25 13.97,7.62; 26 11.43,7.62; 27 8.89,7.62; 28 6.35,7.62; 29 3.81,7.62; 30 1.27,7.62; 31 -1.27,7.62; 32 -3.81,7.62; 33 -6.35,7.62; 34 -8.89,7.62; 35 -11.43,7.62; 36 -13.97,7.62; 37 -16.51,7.62; 38 -19.05,7.62; 39 -21.59,7.62; 40 -24.13,7.62
DIL28 = drill 0.813 long: 1 -16.51,-7.62; 2 -13.97,-7.62; 3 -11.43,-7.62; 4 -8.89,-7.62; 5 -6.35,-7.62; 6 -3.81,-7.62; 7 -1.27,-7.62; 8 1.27,-7.62; 9 3.81,-7.62; 10 6.35,-7.62; 11 8.89,-7.62; 12 11.43,-7.62; 13 13.97,-7.62; 14 16.51,-7.62; 15 16.51,7.62; 16 13.97,7.62; 17 11.43,7.62; 18 8.89,7.62; 19 6.35,7.62; 20 3.81,7.62; 21 1.27,7.62; 22 -1.27,7.62; 23 -3.81,7.62; 24 -6.35,7.62; 25 -8.89,7.62; 26 -11.43,7.62; 27 -13.97,7.62; 28 -16.51,7.62
DIL28-3 = drill 0.813 long: 1 -16.51,-3.81; 2 -13.97,-3.81; 3 -11.43,-3.81; 4 -8.89,-3.81; 5 -6.35,-3.81; 6 -3.81,-3.81; 7 -1.27,-3.81; 8 1.27,-3.81; 9 3.81,-3.81; 10 6.35,-3.81; 11 8.89,-3.81; 12 11.43,-3.81; 13 13.97,-3.81; 14 16.51,-3.81; 15 16.51,3.81; 16 13.97,3.81; 17 11.43,3.81; 18 8.89,3.81; 19 6.35,3.81; 20 3.81,3.81; 21 1.27,3.81; 22 -1.27,3.81; 23 -3.81,3.81; 24 -6.35,3.81; 25 -8.89,3.81; 26 -11.43,3.81; 27 -13.97,3.81; 28 -16.51,3.81
DIL20 = drill 0.813 long: 1 -11.43,-3.81; 2 -8.89,-3.81; 3 -6.35,-3.81; 4 -3.81,-3.81; 5 -1.27,-3.81; 6 1.27,-3.81; 7 3.81,-3.81; 8 6.35,-3.81; 9 8.89,-3.81; 10 11.43,-3.81; 11 11.43,3.81; 12 8.89,3.81; 13 6.35,3.81; 14 3.81,3.81; 15 1.27,3.81; 16 -1.27,3.81; 17 -3.81,3.81; 18 -6.35,3.81; 19 -8.89,3.81; 20 -11.43,3.81
DIL16 = drill 0.813 long: 1 -8.89,-3.81; 2 -6.35,-3.81; 3 -3.81,-3.81; 4 -1.27,-3.81; 5 1.27,-3.81; 6 3.81,-3.81; 7 6.35,-3.81; 8 8.89,-3.81; 9 8.89,3.81; 10 6.35,3.81; 11 3.81,3.81; 12 1.27,3.81; 13 -1.27,3.81; 14 -3.81,3.81; 15 -6.35,3.81; 16 -8.89,3.81
78XXS = drill 1.016 long: GND 0,-2.54; IN -2.54,-2.54; OUT 2.54,-2.54
TO220V = drill 1.016 long: 1 -2.54,-2.54; 2 0,-2.54; 3 2.54,-2.54
SPC4077 = drill 0.8 pad 2.184 long: 1 -3,0; 2 0,-4.8 | drill 1 pad 2.184 long: 3 3,0
JP2 = drill 0.914 long: 1 -2.54,0; 2 0,0; 3 2.54,0
0207/2V = drill 0.813 octagon: 1 -1.27,0; 2 1.27,0
LED5MM = drill 0.813 octagon: A -1.27,0; K 1.27,0
TO92 = drill 0.813 octagon: 1 1.27,0; 2 0,1.905; 3 -1.27,0
TO92-EBC = drill 0.813 long: B 0,-1.27; C -2.54,-1.27; E 2.54,-1.27
SOT54E = drill 0.813 octagon: D -1.27,0; G 0,1.905; S 1.27,0
HC49/S = drill 0.813 round: 1 -2.413,0; 2 2.413,0
RJ9W = drill 0.813 long: A 2.54,0.635; E -2.54,0.635; S 0,0.635
0207/7 = drill 0.813 octagon: 1 -3.81,0; 2 3.81,0
SIL5 = drill 0.813 long: 1 -5.08,0; 2 -2.54,0; 3 0,0; 4 2.54,0; 5 5.08,0
MA13-2 = drill 1.016 octagon: 1 -15.24,-1.27; 2 -15.24,1.27; 3 -12.7,-1.27; 4 -12.7,1.27; 5 -10.16,-1.27; 6 -10.16,1.27; 7 -7.62,-1.27; 8 -7.62,1.27; 9 -5.08,-1.27; 10 -5.08,1.27; 11 -2.54,-1.27; 12 -2.54,1.27; 13 0,-1.27; 14 0,1.27; 15 2.54,-1.27; 16 2.54,1.27; 17 5.08,-1.27; 18 5.08,1.27; 19 7.62,-1.27; 20 7.62,1.27; 21 10.16,-1.27; 22 10.16,1.27; 23 12.7,-1.27; 24 12.7,1.27; 25 15.24,-1.27; 26 15.24,1.27
MA17-2 = drill 1.016 octagon: 1 -20.32,-1.27; 2 -20.32,1.27; 3 -17.78,-1.27; 4 -17.78,1.27; 5 -15.24,-1.27; 6 -15.24,1.27; 7 -12.7,-1.27; 8 -12.7,1.27; 9 -10.16,-1.27; 10 -10.16,1.27; 11 -7.62,-1.27; 12 -7.62,1.27; 13 -5.08,-1.27; 14 -5.08,1.27; 15 -2.54,-1.27; 16 -2.54,1.27; 17 0,-1.27; 18 0,1.27; 19 2.54,-1.27; 20 2.54,1.27; 21 5.08,-1.27; 22 5.08,1.27; 23 7.62,-1.27; 24 7.62,1.27; 25 10.16,-1.27; 26 10.16,1.27; 27 12.7,-1.27; 28 12.7,1.27; 29 15.24,-1.27; 30 15.24,1.27; 31 17.78,-1.27; 32 17.78,1.27; 33 20.32,-1.27; 34 20.32,1.27
3,2 = hole 3.2: 0,0
PN87520 = drill 0.95 long: 1 -3.5,2.71; 2 -1,2.71; 3 1,2.71; 4 3.5,2.71 | hole 2.3: -6.57,0; 6.57,0
TOBU3 = drill 1.397 octagon: 1 0,-2.54 | drill 2.21 octagon: 2 5.588,-2.54; 2@1 -5.588,-2.54; 2@2 0,5.08
MDIN04SS = drill 0.9 octagon: 1 3.4,8.5; 2 -3.4,8.5; 3 3.4,11; 4 -3.4,11 | hole 2.2: -6.75,5.5; 0,4.7; 6.75,5.5

### Placement (x,y rotation side)
C1  44.45,72.39 270 top
C2  44.45,77.47 270 top
C3  69.85,86.36 270 top
C4  76.2,92.71 90 top
C5  71.12,15.24 0 top
C6  71.12,19.05 0 top
C7  73.66,82.55 0 top
C8  22.86,88.9 270 top
C9  138.11,76.2 180 top
C10  38.1,88.9 180 top
C11  30.48,85.09 180 top
C16  24.77,54.61 90 top
C17  10.79,54.61 90 top
C18  16.51,93.98 180 top
C19  17.78,69.22 0 top
C20  17.78,59.05 0 top
C21  55.88,89.53 180 top
C22  119.38,70.64 180 top
C23  139.7,43.18 180 top
C24  82.55,80.01 180 top
C25  35.56,34.29 0 top
C26  60.96,82.55 0 top
C27  66.83,40.32 90 top
C28  69.85,78.74 0 top
C29  106.68,12.7 270 top
C30  153.51,66.99 180 top
C31  153.51,71.44 180 top
C32  69.85,92.08 270 top
C33  109.86,20.32 270 top
C34  53.98,29.21 90 top
C35  104.14,41.27 180 top
C36  54.61,85.09 270 top
C37  101.92,80.01 180 top
C38  105.73,73.66 90 top
C39  134.94,82.55 180 top
D1  96.52,71.12 0 top
D2  128.59,88.27 90 top
D3  104.46,90.17 90 top
IC1  17.14,62.87 0 top
IC2  35.56,48.1 270 top
IC5  78.74,49.53 270 top
IC6  55.88,62.23 270 top
IC8  139.7,54.61 270 top
IC9  118.11,45.72 270 top
IC10  139.7,27.94 270 top
IC11  101.6,29.21 270 top
IC14  119.38,12.7 0 top
IC15  35.56,22.86 270 top
IC18  46.99,96.52 0 top
IC19  101.6,53.34 270 top
IC26  30.48,96.52 0 top
J2  12.7,83.82 0 top
JP1  62.23,93.98 0 top
JP2  46.99,86.36 0 top
L1  131.76,79.38 0 top
L2  97.16,78.74 90 top
LED1  4.45,46.99 270 top
LED2  4.13,37.62 270 top
Q1  60.96,86.36 0 top
Q2  110.17,78.74 270 top
Q3  124.14,79.38 270 top
Q4  17.94,40.96 0 top
Q5  17.78,54.61 0 top
R1  40.16,7.14 180 top
R2  66.04,86.36 270 top
R3  76.2,86.36 90 top
R4  93.98,78.74 90 top
R5  127.32,78.11 270 top
R6  142.56,82.55 0 top
R7  136.21,79.38 180 top
R8  112.71,80.01 270 top
R9  118.75,78.11 90 top
R10  107.63,87 90 top
R11  131.76,76.2 180 top
R12  101.92,74.93 270 top
R13  107.63,92.08 270 top
R14  12.7,36.35 180 top
R16  27.94,62.87 180 top
R17  27.94,65.41 180 top
R30  12.7,45.72 180 top
RN4  82.55,15.24 180 top
SV1  72.39,6.35 0 top
SV2  153.67,43.18 90 top
U$1  [3,2]  154.94,5.08 0 top
U$2  [3,2]  5.08,5.08 0 top
U$3  [3,2]  5.08,95.25 0 top
U$4  [3,2]  154.94,95.25 0 top
X1  149.54,82.23 90 top
X3  137.48,89.53 0 top
X4  87.63,89.53 0 top
X5  118.9,99.38 180 top

### Tracks (layer width: path | path; a pad name or v marks a point on that pad's centre or on a via)
/AEC  (via drill 0.3)
  Top 0.254: SV1.13 71.28,6.19 71.28,12.7 v70.96,13.02 | v37.78,12.86 37.62,13.02 37.62,19.84 38.1,20.32 IC15.10
  Bottom 0.254: v37.78,12.86 70.8,12.86 v70.96,13.02 | v70.96,13.02
/CAS  (via drill 0.3)
  Top 0.254: v83.82,6.35 83.82,12.7 85.09,13.97 RN4.2 85.09,22.7 84.14,23.65 v84.14,27.62
  Bottom 0.254: SV1.9 67.31,5.87 67.63,6.19 67.79,6.35 v83.82,6.35 | v84.14,27.62 83.98,27.46 73.03,27.46 72.55,27.94 IC5.19
/COLOR  (via drill 0.3)
  Top 0.254: v103.82,8.73 v103.82,13.34
  Bottom 0.254: SV1.18 77.47,8.1 78.11,8.73 v103.82,8.73 | v103.82,13.34 | v103.82,13.34 104.14,13.02 122.71,13.02 124.46,14.76 IC14.9
/COLOR_WE  (via drill 0.32)  (1 unrouted)
  Top 0.254: v120.17,59.69 120.17,18.26 120.49,17.94 120.49,12.06 v120.81,11.75 | v41.27,11.11 41.27,22.86 41.59,23.18 v41.59,49.53
  Bottom 0.254: v120.17,59.69 IC9.27 | v120.81,11.75 120.49,12.06 83.03,12.06 82.71,11.75 77.15,11.75 76.83,11.43 41.59,11.43 v41.27,11.11 | v41.59,49.53 34.29,49.53 33.18,50.64 IC2.3
/CS_COLOR  (via drill 0.3)
  Top 0.254: IC14.8 127,41.75 v126.84,41.91
  Bottom 0.254: v126.84,41.91 IC9.20
/IRQ  (via drill 0.3)
  Top 0.254: 60.33,56.83 v60.01,56.83 | 60.33,56.83 | 60.33,56.83 60.33,19.68 60.01,19.37 60.01,18.57 60.8,17.78 60.8,6.67 SV1.5
  Bottom 0.254: IC5.8 66.2,55.88 65.25,56.83 v60.01,56.83
/RAS  (via drill 0.3)
  Top 0.254: v143.51,12.86 IC10.11 | v82.55,12.54 RN4.3 82.55,16.99 81.92,17.62 81.92,28.89 v82.23,28.89
  Bottom 0.254: v82.55,12.54 143.19,12.54 v143.51,12.86 | IC5.18 72.39,30.48 73.18,30.48 74.77,28.89 v82.23,28.89
/RESET  (via drill 0.3)
  Top 0.254: v52.07,68.58 52.07,9.53 v52.07,9.68 | v17.94,9.68 Q4.G
  Bottom 0.254: v52.07,68.58 IC6.5 | SV1.8 64.77,8.73 64.14,9.37 52.39,9.37 v52.07,9.68 51.44,10.32 50.8,10.32 50.16,9.68 v17.94,9.68
/SID  (via drill 0.3)
  Top 0.254: v50.96,9.53 51.59,10.16 51.59,60.17 50.8,60.96 IC6.8
  Bottom 0.254: SV1.4 59.69,8.41 59.21,8.89 52.7,8.89 52.39,8.89 51.59,8.89 v50.96,9.53
/VA14  (via drill 0.3)
  Top 0.254: v43.18,28.89 43.18,27.46 43.18,22.86 v43.5,22.54 | v73.82,22.7 73.82,6.19 SV1.15
  Bottom 0.254: IC15.1 33.5,30.48 35.08,28.89 v43.18,28.89 | v43.5,22.54 43.66,22.38 73.5,22.38 v73.82,22.7
/VA15  (via drill 0.3)
  Top 0.254: IC15.3 33.02,25.4 33.66,24.77 v33.66,12.22 | v76.36,12.54 76.36,6.19 SV1.17
  Bottom 0.254: v33.66,12.22 38.1,12.22 38.26,12.38 76.2,12.38 v76.36,12.54
/VIC  (via drill 0.3)
  Top 0.254: v103.5,62.71 103.5,60.17 103.98,59.69 IC19.15 | v72.87,62.23 72.87,51.28 72.39,50.8 IC5.10 | v65.25,51.59 | v65.25,51.59 64.93,51.91 62.23,51.91 61.75,51.44 61.75,16.19 62.39,15.56 62.39,14.92 61.28,13.97 61.28,8.57 SV1.6
  Bottom 0.254: v103.5,62.71 103.03,62.23 IC19.1 v72.87,62.23 | IC5.10 68.74,50.8 67.94,51.59 v65.25,51.59
A0  (via drill 0.3)
  Top 0.254: IC10.19 145.41,36.83 147.16,35.08 147.16,27.46 147.16,27.15 147.16,24.92 v146.84,24.61 | v112.55,59.05 112.55,40.01 113.19,39.37 IC9.10
  Bottom 0.254: IC6.9 61.12,58.42 62.07,59.37 95.73,59.37 96.04,59.69 IC19.2 99.22,59.69 100.17,58.74 112.55,58.74 v112.55,59.05 | v146.84,24.61 147.16,24.92 150.5,24.92 151.29,24.13 153.67,24.13 SV2.3 | IC9.10 114.78,39.37 115.89,38.26 140.65,38.26 142.08,36.83 IC10.19
A1  (via drill 0.3)
  Top 0.254: v146.21,25.4 146.21,25.56 146.69,26.04 146.69,27.3 146.69,27.46 146.69,32.86 145.26,34.29 IC10.18 | v102.71,55.09 103.5,54.29 v103.5,53.82 | v117.32,53.82 117,53.5 117,46.67 117.47,46.2 117.47,45.56 116.84,44.93 v116.84,41.91 | v125.57,40.48 v125.57,35.56
  Bottom 0.254: IC6.10 61.28,55.88 62.07,55.09 | 62.07,55.09 | 62.07,55.09 62.23,54.93 96.04,54.93 96.36,54.61 IC19.4 102.23,54.61 v102.71,55.09 | v146.21,25.4 SV2.4 | v102.71,55.09 | v102.71,55.09 | v103.5,53.82 103.5,53.66 117.16,53.66 v117.32,53.82 | IC9.9 v116.84,41.91 118.27,40.48 v125.57,40.48 | IC10.18 141.29,34.29 140.02,35.56 v125.57,35.56
A2  (via drill 0.3)
  Top 0.254: v95.73,54.29 95.73,50.01 96.2,49.53 IC19.6 | v145.89,26.83 | v145.89,26.83 146.21,27.15 146.21,30.96 145.41,31.75 IC10.17 | v110.17,49.85 110.17,44.61 v110.33,44.45 | v124.78,43.18 v124.78,33.66
  Bottom 0.254: IC6.11 61.12,53.34 62.23,54.45 95.57,54.45 v95.73,54.29 | SV2.5 154.78,27.94 153.51,26.67 146.37,26.67 v145.89,26.83 | IC19.6 97.95,49.53 99.06,50.64 109.38,50.64 v110.17,49.85 | v110.33,44.45 IC9.8 115.57,44.45 116.84,43.18 v124.78,43.18 | IC10.17 138.11,31.75 136.84,33.02 134.78,33.02 133.99,33.81 124.94,33.81 v124.78,33.66
A3  (via drill 0.3)
  Top 0.254: v111.44,27.62 111.6,27.78 111.6,46.67 v111.28,46.99
  Bottom 0.254: IC6.12 49.37,50.8 50.48,49.69 94.77,49.69 95.89,48.58 100.65,48.58 102.23,46.99 IC19.10 v111.28,46.99 IC9.7 | 143.51,28.26 151.45,28.26 151.76,27.94 SV2.6 | 143.51,28.26 IC10.16 | 143.51,28.26 130.65,28.26 130.18,27.78 129.38,27.78 129.06,27.46 111.6,27.46 v111.44,27.62
A4  (via drill 0.3)
  Top 0.254: v145.41,29.37 145.41,27.46 144.62,26.67 IC10.15 | v110.01,51.91 110.01,51.12 v111.44,49.69 110.65,48.9 110.65,45.4 111.12,44.93 111.12,28.42 110.81,28.1 110.81,27.3 110.81,27.15 v110.81,25.72 | v100.33,47.78 100.33,48.9 100.65,49.21 100.65,49.85 99.85,50.64 v99.85,51.91 | v130.02,25.88 v130.02,29.84
  Bottom 0.254: SV2.7 153.83,29.37 v145.41,29.37 145.41,29.84 145.1,30.16 142.24,30.16 142.08,30 141.45,30 141.29,30.16 130.33,30.16 v130.02,29.84 | v110.01,51.91 109.86,52.07 IC19.12 100.17,52.07 100.01,51.91 v99.85,51.91 | v110.01,51.91 | v111.44,49.69 111.6,49.53 IC9.6 | IC6.13 61.12,48.26 62.07,47.31 95.09,47.31 95.89,48.1 100.01,48.1 v100.33,47.78 | v130.02,25.88 129.86,26.04 111.12,26.04 v110.81,25.72
A5  (via drill 0.3)
  Top 0.254: v141.76,30.8 141.76,24.61 142.24,24.13 IC10.14 | v110.81,52.55 | v110.81,52.55 110.97,52.7 110.97,56.36 v110.17,57.15 | v129.54,53.82 v129.54,30.8
  Bottom 0.254: SV2.8 152.4,30.64 141.92,30.64 v141.76,30.8 | v110.81,52.55 111.28,52.07 IC9.5 115.89,52.07 116.52,52.7 119.86,52.7 120.49,53.34 122.87,53.34 123.67,54.13 129.22,54.13 v129.54,53.82 | IC19.14 v110.17,57.15 | v141.76,30.8 | v141.76,30.8 141.6,30.64 129.7,30.64 v129.54,30.8
A6  (via drill 0.3, 0.32)
  Top 0.254: v116.84,45.88 | v116.84,45.88 116.52,46.2 116.52,54.29 v116.84,54.61 | v148.43,34.29 149.7,35.56 149.7,37.31 149.07,37.94 149.07,44.61 v149.38,44.93 | v148.43,34.29 | v148.43,34.29 148.91,33.81 v148.91,21.59
  Bottom 0.254: v116.84,54.61 IC9.4 | SV2.9 154.62,33.02 153.35,34.29 v148.43,34.29 | v149.38,44.93 148.43,45.4 137.79,45.4 137.32,45.88 v116.84,45.88 | v148.91,21.59 IC10.13
A7  (via drill 0.3)
  Top 0.254: v111.44,51.12 111.44,51.28 111.6,51.44 111.6,56.99 v111.44,57.15 | v147.64,53.82 147.64,35.4 147.64,35.24 147.64,33.34 v147.96,33.02
  Bottom 0.254: IC5.31 91.28,50.8 91.6,51.12 v111.44,51.12 | v111.44,57.15 IC9.3 115.41,57.15 116.52,58.26 123.35,58.26 123.83,57.78 124.78,57.78 125.25,58.26 137.48,58.26 142.24,53.5 147.32,53.5 v147.64,53.82 | v147.96,33.02 SV2.10
A8  (via drill 0.3)
  Top 0.254: v138.27,53.18 v138.27,46.2 | v149.07,45.88 148.59,45.4 148.59,37.31 v148.91,36.99 | v148.91,36.99
  Bottom 0.254: IC5.32 88.74,53.34 89.06,53.18 119.54,53.18 120.97,54.61 IC9.25 133.35,54.61 134.46,53.5 137.95,53.5 v138.27,53.18 | v138.27,46.2 138.59,45.88 v149.07,45.88 | v148.91,36.99 153.51,36.99 SV2.11
A9  (via drill 0.3)
  Top 0.254: v124.62,56.2 | v124.62,56.2 124.46,56.04 124.46,52.23 v124.62,52.07 | v148.43,51.44 148.11,51.12 148.11,35.88 v148.43,35.56
  Bottom 0.254: IC5.33 87.95,55.88 88.42,55.4 96.04,55.4 96.36,55.72 124.14,55.72 v124.62,56.2 | IC9.24 v124.62,52.07 133.03,52.07 134.3,50.8 138.91,50.8 139.38,50.32 142.08,50.32 142.56,50.8 147.8,50.8 v148.43,51.44 | v148.43,35.56 SV2.12
A10  (via drill 0.3)
  Top 0.254: v89.06,21.11 v89.06,58.42 | v156.69,20.8 | v156.69,20.8 157,21.11 157,22.07 156.69,22.38 156.69,37.78 v157,38.1
  Bottom 0.254: v89.06,58.42 IC5.34 | v89.06,21.11 89.38,21.43 108.58,21.43 109.54,22.38 110.17,22.38 111.92,20.64 150.97,20.64 151.13,20.8 v156.69,20.8 | v157,38.1 SV2.13
A11  (via drill 0.3)
  Top 0.254: v127.64,30.64 127.48,30.48 127.48,18.41 128.11,17.78 128.11,12.06 v128.43,11.75 | v156.37,12.7 156.37,19.53 157.48,20.64 157.48,22.38 157.16,22.7 157.16,36.99 157.8,37.62 157.8,38.58 v157,39.37
  Bottom 0.254: IC5.23 88.27,30.48 89.06,29.69 | 89.06,29.69 | 89.06,29.69 89.22,29.53 102.39,29.53 102.55,29.69 103.5,29.69 103.82,29.37 107.31,29.37 108.58,30.64 v127.64,30.64 | v128.43,11.75 128.43,11.91 128.59,12.06 155.73,12.06 v156.37,12.7 | v156.37,12.7 | v157,39.37 153.67,39.37 SV2.14
A12  (via drill 0.3)
  Top 0.254: v157,40.64 157.16,40.64 158.12,39.69 | 158.12,39.69 | 158.12,39.69 158.27,39.53 158.27,37.31 157.64,36.67 157.64,23.18 157.96,22.86 157.96,20.48 156.84,19.37 156.84,13.18 157,13.02 157,12.38 v156.37,11.75 | v99.06,11.11 99.06,19.21 99.38,19.53 99.54,19.68 99.54,32.23 98.74,33.02 IC11.3
  Bottom 0.254: v157,40.64 SV2.15 | v156.37,11.75 156.21,11.59 155.73,11.59 129.22,11.59 128.75,11.11 127.95,11.11 127,12.06 122.24,12.06 121.13,10.95 120.49,10.95 119.86,11.59 99.54,11.59 v99.06,11.11
A13  (via drill 0.3)
  Top 0.254: v150.81,27.3 150.81,39.05 SV2.16
  Bottom 0.254: IC11.5 98.58,27.94 99.54,26.99 129.38,26.99 129.7,27.3 130.33,27.3 130.65,27.62 150.5,27.62 v150.81,27.3
A14  (via drill 0.3)
  Top 0.254: v156.21,21.75 156.21,41.91 SV2.17
  Bottom 0.254: IC11.7 102.87,22.86 103.98,23.97 130.02,23.97 131.13,22.86 148.59,22.86 150.18,21.27 155.73,21.27 v156.21,21.75
A15  (via drill 0.3)
  Top 0.254: v153.67,19.84 153.67,41.91 SV2.18
  Bottom 0.254: IC11.9 110.65,20.32 110.81,20.16 153.35,20.16 v153.67,19.84
AEC  (via drill 0.3)
  Top 0.254: v40.8,35.4 41.12,35.24 41.12,27.94 | IC15.11 40.48,22.86 41.12,23.5 41.12,27.94 | IC8.5 IC8.6 134.78,49.53 134.14,48.9 134.14,45.88 135.89,44.13 IC10.1 136.84,39.37 137.79,38.42 v137.79,18.57 | IC8.13 IC8.12 141.92,57.15 141.45,56.67 v141.45,52.07 | v80.01,37.15 RN4.4 80.01,13.18 80.49,12.7 80.49,9.21 81.28,8.41 81.28,6.19 82.39,5.08 SV1.21 | v103.82,14.45 103.66,14.61 103.66,34.92 104.38,35.64 105.33,35.64 IC11.15 | 41.12,27.94 IC15.13
  Bottom 0.254: IC11.15 104.46,35.56 103.35,36.67 101.92,38.1 IC11.1 96.2,38.1 95.25,37.15 v80.01,37.15 74.14,37.15 72.55,35.56 IC5.16 41.12,35.56 v40.8,35.4 | IC8.5 v141.45,52.07 | v103.82,14.45 104.78,13.49 121.44,13.49 121.92,13.97 IC14.10 121.92,17.62 122.56,18.26 134.14,18.26 134.3,18.1 137.32,18.1 v137.79,18.57
AUDIO_OUT
  Bottom 0.406: C4.- 76.36,94.14 84.14,94.14 87.63,90.65 X4.1
BA  (via drill 0.3)
  Top 0.254: RN4.5 78.26,16.03 78.26,16.51 78.74,16.99 78.74,27.46 78.42,27.78 78.42,28.42 79.53,29.53 79.53,36.67 79.38,36.83 v79.38,45.72 | v68.58,13.49 68.42,13.34 68.42,6.51 SV1.11
  Bottom 0.254: v79.38,45.72 IC5.12 | 70.17,13.49 70.33,13.65 71.44,13.65 71.91,13.18 75.88,13.18 77.47,14.76 RN4.5 | 70.17,13.49 | 70.17,13.49 70.01,13.34 68.42,13.34 v68.58,13.49
CHROMA_OUT
  Bottom 0.305: R10.2 R13.2 113.19,90.81 114.46,92.08 118.61,92.08 X5.4
COLCLK  (via drill 0.3)
  Top 0.254: v45.09,23.81 45.24,23.81 45.4,23.97 45.4,62.55 45.09,62.87 v44.93,62.87
  Bottom 0.254: IC5.21 86.04,25.4 84.93,26.51 50.96,26.51 50.8,26.35 50.8,24.45 50.16,23.81 v45.09,23.81 | v44.93,62.87 R16.1
COLOR  (via drill 0.3)
  Top 0.254: v73.98,77.63 73.98,41.75 72.87,40.64 IC5.14
  Bottom 0.254: v73.98,77.63 93.82,77.63 R4.1
  Bottom 0.305: R4.1 L2.1
COMP_OUT
  Bottom 0.305: R7.1 C39.1 | C39.1 X3.1 | C39.1 R6.1
D0
  Top 0.254: IC5.7 69.69,58.42 69.53,58.26 | 69.53,58.26 | 69.53,58.26 69.37,58.1 69.37,50.8 64.29,45.72 IC6.15
  Bottom 0.254: SV2.23 155.73,50.8 156.37,51.44 156.37,53.98 155.73,54.61 IC8.11 142.56,54.61 138.43,58.74 125.09,58.74 124.62,58.26 123.98,58.26 123.51,58.74 113.67,58.74 113.19,58.26 90.01,58.26 89.06,57.31 | IC5.7 83.5,58.42 84.61,57.31 89.06,57.31 | 89.06,57.31
D1  (via drill 0.3)
  Top 0.254: IC5.6 68.9,60.96 68.9,51.12 66.04,48.26 IC6.16 | v140.65,60.33 140.65,52.7 140.65,47.15 140.81,46.99 IC8.8
  Bottom 0.254: SV2.24 148.91,50.8 145.1,46.99 IC8.8 | IC5.6 84.14,60.96 85.25,59.85 87.47,59.85 88.9,61.28 139.86,61.28 v140.65,60.33
D2  (via drill 0.3)  (2 unrouted)
  Top 0.254: IC5.5 68.9,63.5 68.42,63.02 68.42,51.44 67.79,50.8 IC6.17 | v134.14,65.41 134.14,54.93 134.46,54.61 IC8.4
  Bottom 0.254: IC5.5 v82.55,63.5 84.14,63.5 85.25,64.61 106.36,64.61 106.84,65.09 | IC8.4 137.79,54.61 139.38,53.02 147.8,53.02 148.75,52.07 153.67,52.07 SV2.25 | 106.84,65.09 | 106.84,65.09 107,65.25 133.99,65.25 v134.14,65.41
D3  (via drill 0.3)
  Top 0.254: IC5.4 68.9,66.04 67.94,65.09 67.94,54.29 66.99,53.34 IC6.18 | v135.89,65.41 IC8.1 | v149.07,60.17 149.07,54.13 v149.86,53.34
  Bottom 0.254: IC5.4 83.98,66.04 84.93,65.09 106.05,65.09 106.68,65.72 133.51,65.72 133.83,66.04 135.25,66.04 v135.89,65.41 | IC8.1 140.81,62.23 142.08,60.96 148.27,60.96 v149.07,60.17 | v149.86,53.34 SV2.26
D4  (via drill 0.3)
  Top 0.254: IC5.3 69.69,68.58 67.47,66.36 67.47,58.1 65.25,55.88 IC6.19 | v148.27,67.15 v148.27,57.31
  Bottom 0.254: IC5.3 78.58,68.58 80.17,66.99 89.69,66.99 90.01,67.31 114.46,67.31 114.94,66.83 115.89,66.83 116.52,67.79 146.37,67.79 147,67.15 v148.27,67.15 | v148.27,57.31 148.43,57.15 153.67,57.15 SV2.27
D5  (via drill 0.3)
  Top 0.254: IC5.2 69.69,71.12 66.99,68.42 66.99,60.48 64.93,58.42 IC6.20 | v147.32,67.94 | v147.32,67.94 147.48,67.79 147.48,66.67 147.8,66.36 147.8,57.94 147.48,57.63 147.48,56.99 148.27,56.2 v148.27,56.04
  Bottom 0.254: v147.32,67.94 147,68.26 117.32,68.26 116.2,68.26 115.57,67.31 115.09,67.31 114.62,67.79 89.85,67.79 89.53,67.47 80.33,67.47 76.99,70.96 72.71,70.96 72.55,71.12 IC5.2 | v148.27,56.04 148.43,55.88 SV2.28
D6  (via drill 0.3)
  Top 0.254: IC5.1 69.85,73.66 66.52,70.33 66.52,62.71 64.77,60.96 IC6.21 | v147.96,69.53 147.96,68.42 148.91,67.47 148.91,61.44 150.02,60.33 150.02,59.69 v149.86,59.53 | v149.86,59.53 | v149.86,59.53 150.02,59.53
  Bottom 0.254: IC5.1 84.14,73.66 85.09,72.71 87.63,72.71 87.95,73.03 94.14,73.03 97.95,69.22 147.64,69.22 v147.96,69.53 | SV2.29 | SV2.29 153.83,59.53 v149.86,59.53
D7  (via drill 0.3)
  Top 0.254: v84.14,64.45 84.14,70.33 84.93,71.12 IC5.39 | SV2.30 151.29,58.42 150.65,59.05 150.65,60.48 149.38,61.75 149.38,67.31 149.38,67.94 v148.75,68.74 | v148.75,68.74
  Bottom 0.254: IC6.22 68.9,63.5 69.85,64.45 v84.14,64.45 | IC5.39 89.22,71.12 91.6,68.74 v148.75,68.74 | v148.75,68.74 | v148.75,68.74 148.59,68.58
D8  (via drill 0.3)
  Top 0.254: 116.05,66.36 116.05,37.31 115.57,36.83 IC9.11 | 116.05,66.36 v115.25,68.1 | v139.54,51.44 | v139.54,51.44 139.7,51.59 139.7,59.53 139.38,59.85 139.38,65.88 v138.75,66.52 | 116.05,66.36 v117.16,66.36
  Bottom 0.254: IC5.38 89.53,68.58 89.69,68.42 | 89.69,68.42 | 89.69,68.42 89.85,68.26 115.09,68.26 v115.25,68.1 | IC8.10 142.72,52.07 141.76,51.12 139.86,51.12 v139.54,51.44 | v138.75,66.52 | v138.75,66.52 138.43,66.83 117.63,66.83 v117.16,66.36
D9  (via drill 0.3)
  Top 0.254: v111.76,66.67 111.76,58.58 112.08,58.26 112.08,34.61 112.39,34.29 IC9.12 | v139.86,49.53 140.18,49.85 140.18,59.69 139.86,60.01 v139.86,66.99
  Bottom 0.254: IC5.37 90.81,66.04 91.44,66.67 v111.76,66.67 114.46,66.67 114.78,66.36 116.2,66.36 116.84,67.31 139.7,67.31 139.86,67.15 v139.86,66.99 | v139.86,49.53 IC8.9
D10  (via drill 0.3)
  Top 0.254: IC5.36 85.09,63.5 83.66,62.07 v83.66,57.15 83.66,52.23 83.03,51.59 83.03,38.89 82.71,38.58 82.71,35.72 83.82,34.61 v83.82,32.07
  Bottom 0.254: IC8.3 124.46,57.15 123.51,56.2 88.74,56.2 88.11,56.83 83.98,56.83 v83.66,57.15 | IC9.13 108.9,31.75 108.58,31.43 88.74,31.43 88.27,31.91 85.09,31.91 84.93,32.07 v83.82,32.07
D11  (via drill 0.3)
  Top 0.254: v88.74,60.17 88.11,60.8 | 88.11,60.8 | 88.11,60.8 87.95,60.96 IC5.35 | IC9.15 123.51,29.21 123.83,29.53 123.83,58.42 v124.3,58.9
  Bottom 0.254: IC8.2 133.51,59.69 132.4,60.8 124.14,60.8 | 124.14,60.8 89.38,60.8 v88.74,60.17 | v124.3,58.9 124.3,60.64 124.14,60.8
DOTCLK  (via drill 0.3)
  Top 0.254: SV1.19 79.38,5.08 78.74,5.71 78.74,16.35 79.22,16.83 v79.22,28.26 | R17.1 29.84,65.41 29.37,64.93 v29.37,31.75
  Bottom 0.254: IC5.22 85.09,27.94 84.61,28.42 83.66,28.42 83.19,27.94 79.22,27.94 | 79.22,27.94 73.5,27.94 72.55,28.89 44.45,28.89 43.81,29.53 35.24,29.53 33.18,31.59 29.53,31.59 v29.37,31.75 | 79.22,27.94 v79.22,28.26
EXT-IN
  Top 0.406: C7.1 71.12,76.83 67.94,73.66 IC6.26
GND  (via drill 0.3, 0.6)
  other vias: 102.55,33.02 55.88,38.73 56.52,24.77 92.55,43.02 127,48.9 57.78,70.48 64.14,24.77 76.83,41.91 13.34,64.14 42.86,60.33 101.6,20.32 118.11,48.9 56.52,17.14
  pour Bottom: 0,100.33 160.02,100.33 160.02,0 0,0
  pour Top: 0,100.01 0,0 160.02,0 160.02,100.33 0,100.33
GR/W  (via drill 0.32)
  Top 0.254: SV1.20 80.01,12.22 v79.69,12.54 | v28.89,11.59 28.89,31.27 28.73,31.43 28.73,32.07 28.89,32.23 28.89,44.13 v28.57,44.45
  Bottom 0.254: v79.69,12.54 79.38,12.22 76.99,12.22 76.68,11.91 38.42,11.91 38.26,11.75 34.13,11.75 33.97,11.59 v28.89,11.59 | IC2.10 IC2.9 | v28.57,44.45 28.73,44.29 39.37,44.29 IC2.10 | IC2.10
LUMA_OUT
  Bottom 0.305: R11.2 130.49,76.99 131.76,78.26 131.76,80.64 130.49,81.92 | 130.49,81.92 R5.1 | 130.49,81.92 130.49,82.07 130.49,84.93 128.91,86.52 118,86.52 X5.3
MA0  (via drill 0.3)
  Top 0.254: v89.85,56.83 89.53,56.52 89.53,33.18 v89.85,32.86 | v134.14,32.7 134.14,36.2 134.78,36.83 IC10.2
  Bottom 0.254: IC19.3 90.17,57.15 v89.85,56.83 | IC5.24 89.69,33.02 v89.85,32.86 94.46,32.86 95.73,34.13 108.27,34.13 109.22,33.18 124.14,33.18 124.62,32.7 v134.14,32.7
MA1  (via drill 0.3)
  Top 0.254: v84.61,52.23 84.3,52.23 83.5,51.44 83.5,38.73 83.19,38.42 83.19,36.2 v83.82,35.56 | v95.25,39.37 95.57,39.69 95.57,49.37 95.09,49.85 v95.09,52.07
  Bottom 0.254: IC19.5 v95.09,52.07 84.77,52.07 v84.61,52.23 | v83.82,35.56 IC5.25 | v95.25,39.37 98.9,39.37 99.54,38.73 102.08,38.73 104.14,36.67 106.84,36.67 108.11,35.4 123.35,35.4 123.51,35.24 124.46,34.29 IC10.3
MA2  (via drill 0.3)
  Top 0.254: v84.14,46.51 84.14,38.42 v83.82,38.1 | v95.89,32.07 96.04,32.23 96.04,46.67 96.36,46.99 IC19.7
  Bottom 0.254: IC19.7 95.57,46.99 95.41,46.83 84.45,46.83 v84.14,46.51 | v83.82,38.1 IC5.26 | v95.89,32.07 96.04,31.91 108.27,31.91 109.06,32.7 123.98,32.7 124.94,31.75 IC10.4
MA3  (via drill 0.3)
  Top 0.254: IC19.9 105.41,41.12 104.62,40.32 v103.19,40.32 103.19,29.21 v102.87,28.89
  Bottom 0.254: IC5.27 100.17,40.64 100.49,40.32 v103.19,40.32 | v102.87,28.89 107.47,28.89 108.74,30.16 123.19,30.16 124.14,29.21 IC10.5
MA4  (via drill 0.3)
  Top 0.254: IC5.28 87.31,43.18 88.27,42.23 v88.27,35.56 v88.27,27.94 | v99.85,49.53 99.54,49.21 99.54,36.2 98.9,35.56 IC11.2
  Bottom 0.254: v88.27,35.56 IC11.2 | v99.85,49.53 IC19.11 | v88.27,27.94 88.74,27.46 94.77,27.46 95.73,26.51 129.54,26.51 129.7,26.67 IC10.6
MA5  (via drill 0.3)
  Top 0.254: v84.61,31.27 84.61,45.4 84.93,45.72 IC5.29 | v96.04,24.61 96.04,30.16 96.36,30.48 IC11.4 | 90.01,45.88 90.01,53.5 v90.33,53.82 | 90.01,45.88 | v90.33,45.56 90.01,45.88
  Bottom 0.254: IC11.4 89.06,30.48 88.11,31.43 84.77,31.43 v84.61,31.27 | v96.04,24.61 96.2,24.45 130.65,24.45 130.97,24.13 IC10.7 | IC19.13 103.19,54.61 102.23,53.66 90.49,53.66 v90.33,53.82 | IC5.29 86.84,45.24 90.01,45.24 v90.33,45.56
MA6  (via drill 0.32)
  Top 0.254: v109.38,46.2 | v109.38,46.2 109.7,45.88 109.7,44.13 110.01,43.81 110.33,43.81 110.65,43.5 110.65,28.57 110.33,28.26 110.33,26.19 110.17,26.04 110.17,23.97 v110.81,23.18 | v88.27,46.04 88.27,47.78 87.79,48.26 IC5.30
  Bottom 0.254: IC10.8 135.1,22.38 130.97,22.38 129.86,23.5 111.12,23.5 v110.81,23.18 | v88.27,46.04 88.27,46.2 88.42,46.35 94.46,46.35 94.77,46.04 109.22,46.04 v109.38,46.2 | v110.81,23.18
N$1
  Bottom 0.254: C2.1 IC6.1
N$2
  Bottom 0.254: C2.2 IC6.2
N$3
  Bottom 0.254: C1.2 IC6.4
N$4
  Bottom 0.254: C1.1 IC6.3
N$5
  Bottom 0.305: R8.1 Q2.C 108.9,81.92 D3.C
N$6
  Top 0.406: R3.2 C4.+ 73.66,91.44 71.75,93.34 C32.1
  Bottom 0.406: Q1.1 74.93,86.36 R3.2
N$7
  Top 0.406: C3.1 C32.2
  Bottom 0.406: Q1.2 65.41,88.27 R2.1 C3.1
N$8
  Top 0.406: LED1.K R30.2
N$9
  Bottom 0.254: IC15.6 IC15.9
N$10
  Bottom 0.305: D1.A 102.55,71.12 104.46,73.03 117.47,73.03 R9.1 118.75,75.25 Q3.B
N$11
  Bottom 0.305: R12.1 C38.2 105.73,78.74 | R8.2 Q2.B 105.73,78.74 | 105.73,78.74 C37.1
N$12
  Bottom 0.305: R9.2 Q3.C 124.3,81.92 126.84,84.45 D2.C
N$13
  Bottom 0.305: L1.2 R7.2 135.57,78.74 C9.2
N$14  (via drill 0.32)
  Top 0.254: C34.1 53.02,27.94 52.55,27.46 52.55,10.16 52.86,9.84 v52.86,8.1 | R1.S v40.16,8.89
  Bottom 0.254: v52.86,8.1 52.55,8.41 50.96,8.41 50.16,9.21 40.48,9.21 v40.16,8.89
N$15
  Bottom 0.305: 127.32,79.38 125.41,79.38 Q3.E | 127.32,79.38 L1.1 | 127.32,79.38 R5.2
N$16
  Top 0.254: R1.A 37.62,12.06 37.15,12.54 37.15,25.08 37.47,25.4 IC15.12
N$17
  Top 0.406: LED2.K R14.2 | R14.2
N$18
  Top 0.406: R14.1 16.51,40.8 Q4.D
N$19
  Bottom 0.305: L2.2 C37.2
N$20
  Top 0.254: IC2.8 37.78,40.48 37.62,40.64 37.62,50.48 37.78,50.64 IC2.12 | IC2.12 | IC2.12 IC2.13
N$21  (via drill 0.32)
  Top 0.254: v28.1,43.02 28.1,43.81 27.78,44.13 27.78,44.77 28.89,45.88 28.89,55.4 v28.57,55.72
  Bottom 0.254: IC2.6 28.26,43.02 v28.1,43.02 | v28.57,55.72 IC2.1 | IC2.1
N$22
  Top 0.254: C17.1 14.1,53.34 Q5.1 17.46,56.71 17.46,60.01 17.14,60.33 IC1.7
N$23
  Top 0.254: C16.1 21.46,53.34 Q5.2 20.16,54.61 18.1,56.67 18.1,60.33 17.78,60.64 IC1.8
N$24
  Top 0.254: R16.2 18.57,62.87 17.14,64.29 IC1.22
N$25
  Top 0.254: R17.2 18.26,65.41 17.78,65.88 IC1.21
N$26
  Top 0.254: IC2.5 IC2.4
  Bottom 0.254: IC2.4 IC2.11
N$27  (via drill 0.6)
  other vias: 21.27,64.14
N$28  (via drill 0.6)
  other vias: 26.35,74.93
N$29
  Bottom 0.305: Q2.E 113.51,76.2 114.78,77.47 114.78,83.19 112.24,85.72 R10.1 111.44,89.53 117.32,89.53 119.54,87.31 123.98,87.31 126.52,89.85 133.51,89.85 134.94,88.42 134.94,85.09 C39.2
N$30  (via drill 0.6)
  other vias: 3.81,12.06
N$31  (via drill 0.6)
  other vias: 24.77,2.06
N$32  (via drill 0.6)
  other vias: 12.06,29.84
N$33  (via drill 0.6)
  other vias: 99.69,2.86
N$34  (via drill 0.6)
  other vias: 143.03,7.14
N$35  (via drill 0.6)
  other vias: 150.65,97.31
N$36  (via drill 0.6)
  other vias: 133.51,71.44
N$37  (via drill 0.6)
  other vias: 99.06,90.65
N$38  (via drill 0.6)
  other vias: 117.16,84.14
N$39  (via drill 0.6)
  other vias: 78.42,56.99
N$40  (via drill 0.6)
  other vias: 1.11,98.74
N$41  (via drill 0.6)
  other vias: 23.34,47.94
PHI0  (via drill 0.3)
  Top 0.254: SV1.10 v67.31,21.11 67.31,31.75 68.58,33.02 IC5.17 | IC15.5 30.32,20.32 30,20.64 30,32.07 29.84,32.23 29.84,53.02 30,53.18 IC2.2
  Bottom 0.254: v67.31,21.11 66.99,21.43 32.86,21.43 IC15.5
POTX  (via drill 0.3)
  Top 0.254: SV1.14 72.39,13.65 71.12,14.92 71.12,17.78 C6.1 | IC6.24 61.75,68.58 60.8,67.63 60.8,19.21 v60.64,18.89
  Bottom 0.254: v60.64,18.89 60.8,19.05 C6.1
POTY  (via drill 0.3)
  Top 0.254: v74.93,13.97 SV1.16 | IC6.23 61.59,66.04 61.28,65.72 61.28,15.56 v61.59,15.24
  Bottom 0.254: v74.93,13.97 74.61,13.65 72.23,13.65 71.75,14.13 70.96,14.13 C5.1 v61.59,15.24
R/W  (via drill 0.3)
  Top 0.254: v46.51,49.21 46.35,49.37 46.35,62.87 46.99,63.5 IC6.7 | v46.35,7.46 46.35,49.05 v46.51,49.21 | v46.51,49.21
  Bottom 0.254: IC5.11 66.2,48.26 65.25,49.21 v46.51,49.21 | SV1.3 59.69,5.87 59.21,6.35 47.47,6.35 v46.35,7.46
ROW4  (via drill 0.3)
  Top 0.254: v81.6,53.82 | v81.6,53.82 81.44,53.66 81.44,10.79 82.55,9.68 SV1.22
  Bottom 0.254: IC5.9 72.39,53.34 73.03,53.98 81.44,53.98 v81.6,53.82
SID_AUDIO_OUT
  Top 0.406: IC6.27 64.93,76.2 66.04,77.31 R2.2
SID_PHI2  (via drill 0.3)
  Top 0.254: IC6.6 46.35,66.04 45.88,65.56 45.88,15.56 v45.72,15.4 | v45.72,15.4
  Bottom 0.254: v45.72,15.4 45.56,15.24 IC15.8
SYNC  (via drill 0.3)
  Top 0.254: 73.03,38.1 IC5.15 | 73.03,38.1 73.98,38.1 74.93,39.05 74.93,71.91 v75.41,72.39 | v72.87,29.53 72.87,29.69 73.03,29.84 73.03,38.1
  Bottom 0.254: v75.41,72.39 75.41,72.23 75.72,72.07 91.76,72.07 D1.C | C34.2 | C34.2 68.1,30.48 68.58,30.48 69.53,29.53 v72.87,29.53
V9
  Top 0.813: JP2.3 IC18.OUT
  Bottom 0.813: JP2.3 C36.+
V12
  Top 0.813: JP1.1 59.69,89.53 | 59.69,89.53 Q1.3 | 44.45,92.08 IC18.IN JP2.1 | 25.56,91.6 25.72,91.44 | 59.69,89.53 C21.1
  Top 1.676: 25.4,91.44 25.56,91.6 | 19.05,91.44 18.29,92.2
  Top 1.778: J2.3 15.7,90.63 16.51,91.44 19.05,91.44 C8.1 25.4,91.44 | 25.56,91.6 IC26.1 | 18.29,92.2 C18.+
  Bottom 0.813: JP1.1 56.04,93.98 53.34,91.28 45.24,91.28 44.45,92.08 IC18.IN
  Bottom 1.27: IC18.IN 38.1,93.98 35.56,91.44 27.94,91.44 IC26.1
V_SID  (via drill 0.6)
  Top 1.27: v53.18,78.74 53.02,78.74 46.99,84.77 JP2.2
  Bottom 1.27: C28.1 IC6.28 v53.18,78.74
V_VIC  (via drill 0.6)
  Top 1.016: JP1.2 62.23,89.53 63.66,87.47 63.66,85.57 60.64,82.55 v60.64,77.31 | v56.04,77.31 56.04,45.09 v56.04,43.02
  Bottom 0.813: 66.67,43.02 C27.2
  Bottom 1.016: IC5.13 67.15,43.18 C27.2 | v56.04,77.31 v60.64,77.31 | v56.04,43.02 66.67,43.02
VA14
  Bottom 0.254: IC15.2 33.34,27.94 | IC11.6 96.2,25.4 94.61,26.99 34.29,26.99 33.34,27.94 | 33.34,27.94
VA15
  Bottom 0.254: IC15.4 33.18,22.86 34.13,21.91 103.03,21.91 103.82,22.7 | 103.82,22.7 | 103.82,22.7 103.98,22.86 IC11.10
VCC  (via drill 0.6)  (1 unrouted)
  Top 0.254: 1.91,75.09 2.06,74.93 | C20.1 IC1.6 | C19.1 IC1.23
  Top 0.406: 1.91,73.66 1.91,73.03
  Top 0.813: 1.59,69.22 C19.1 | 1.59,59.05 C20.1 | 128.59,97.79 D2.A | D3.A 104.46,97.47 104.14,97.79
  Top 1.016: IC19.16 107.79,62.23 107.79,41.27 | 107.79,41.27 107.79,38.1 | 107.79,38.1 IC11.16 107.79,38.1 | 107.79,38.1 107.79,21.75 | 107.79,21.75 107.79,16.35 | 111.76,16.35 107.95,16.35 106.84,15.24 | IC8.14 146.05,62.23 146.05,39.37 IC10.20 142.24,40.64 C23.1 | 1.59,48.26 LED1.A | 1.59,48.26 1.59,59.05 1.59,69.22 1.59,73.34 1.75,73.5 | C25.1 33.02,37.47 33.97,38.42 33.97,55.72 | 33.97,55.72 33.97,83.38 C11.+ | C33.+ 108.2,21.34 107.79,21.75 | 107.79,41.27 C35.1 | LED2.A 1.59,38.89 1.59,48.26 | 33.97,55.72 IC2.14
  Top 1.27: 33.02,97.95 11.43,97.95 10.16,96.68 10.16,93.03 7.3,90.17 3.17,90.17 1.91,88.9 1.91,75.09 1.91,73.66 1.75,73.5 | 86.36,80.01 IC5.40 | 86.36,80.01 C24.1 | IC6.25 61.44,71.12 57.47,75.09 57.47,82.55 | 57.47,82.55 57.47,87.31 56.52,88.27 56.52,97.95 | 57.47,82.55 C26.1 | 107.79,16.35 107.95,16.35 | 111.76,16.35 IC14.14 | 106.84,15.24 C29.1 | 86.36,80.01 | 86.36,80.01 84.93,81.44 84.93,97.79 84.93,97.95 84.77,97.95 | IC9.28 v121.92,64.14 121.92,69.22 C22.1 | C25.1
  Top 1.422: 157.96,78.73 X1.1
  Top 1.676: 64.77,97.95 JP1.3 | 33.02,88.9 C10.2
  Top 1.778: C11.+ 33.02,85.85 33.02,88.9 IC26.3 33.02,97.95 56.52,97.95 64.77,97.95 84.77,97.95 | 157.96,71.44 157.96,78.73 157.96,84.77 157.8,85.09 145.1,97.79 128.59,97.79 104.14,97.79 84.93,97.79 | 157.96,66.99 157.96,63.5 | 157.96,63.5 157.96,60.96 SV2.31 SV2.32 | 157.96,66.99 C30.1 | 157.96,71.44 C31.+ | 157.96,71.44 157.96,66.99 | SV2.34 SV2.33 157.96,63.5
  Bottom 0.406: C29.1 RN4.1 | C29.1
  Bottom 1.016: IC15.14 36.83,30.48 C25.1
  Bottom 1.27: IC19.16 107.31,64.14 v121.92,64.14 141.6,64.14 IC8.14 148.91,62.23 150.18,60.96 SV2.32 SV2.31

### Text on the board
tPlace: 12V | 5V | AUDIO | COMP | VIC voltage | S-VIDEO | 12V | 9V | SID voltage | 12V | USB | ICS525-02 | POWER | SID | RESET | color RAM | VIC-II | luma fix | SPC64 1.1 2019-2020 | C:/Users/svpet/Pictures/ham_black_mono.bmp